# EAGLE board DATALOGGER_ADS_V1 (EAGLE 9.6.2), part 1 of 2
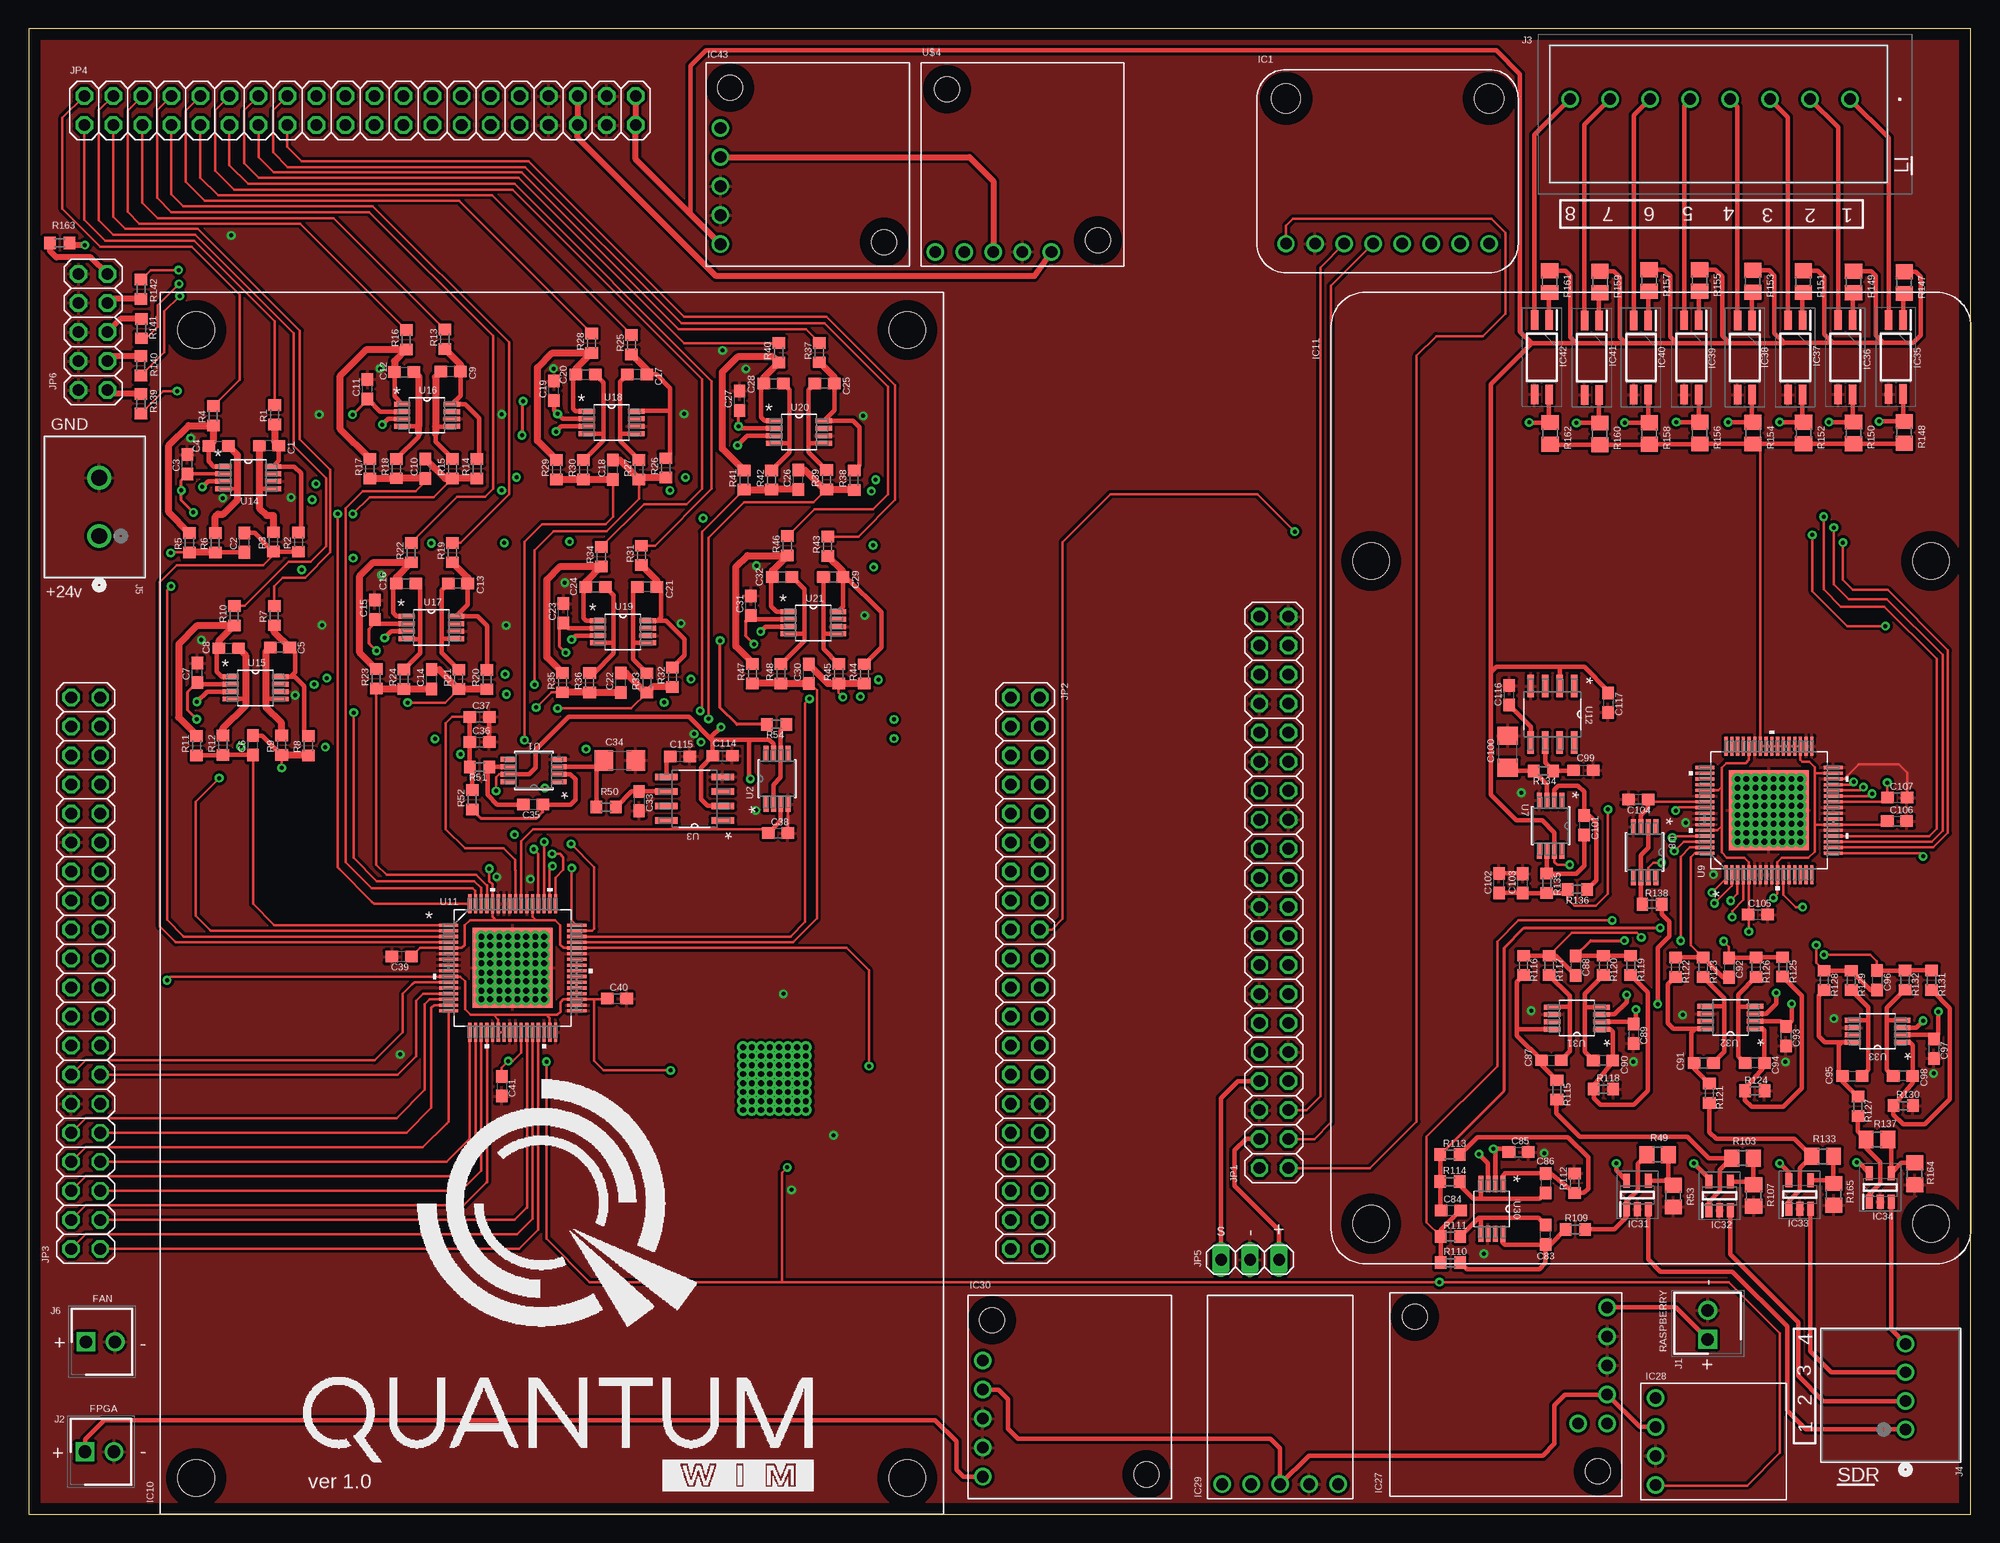
[diagram p21: board, top side]
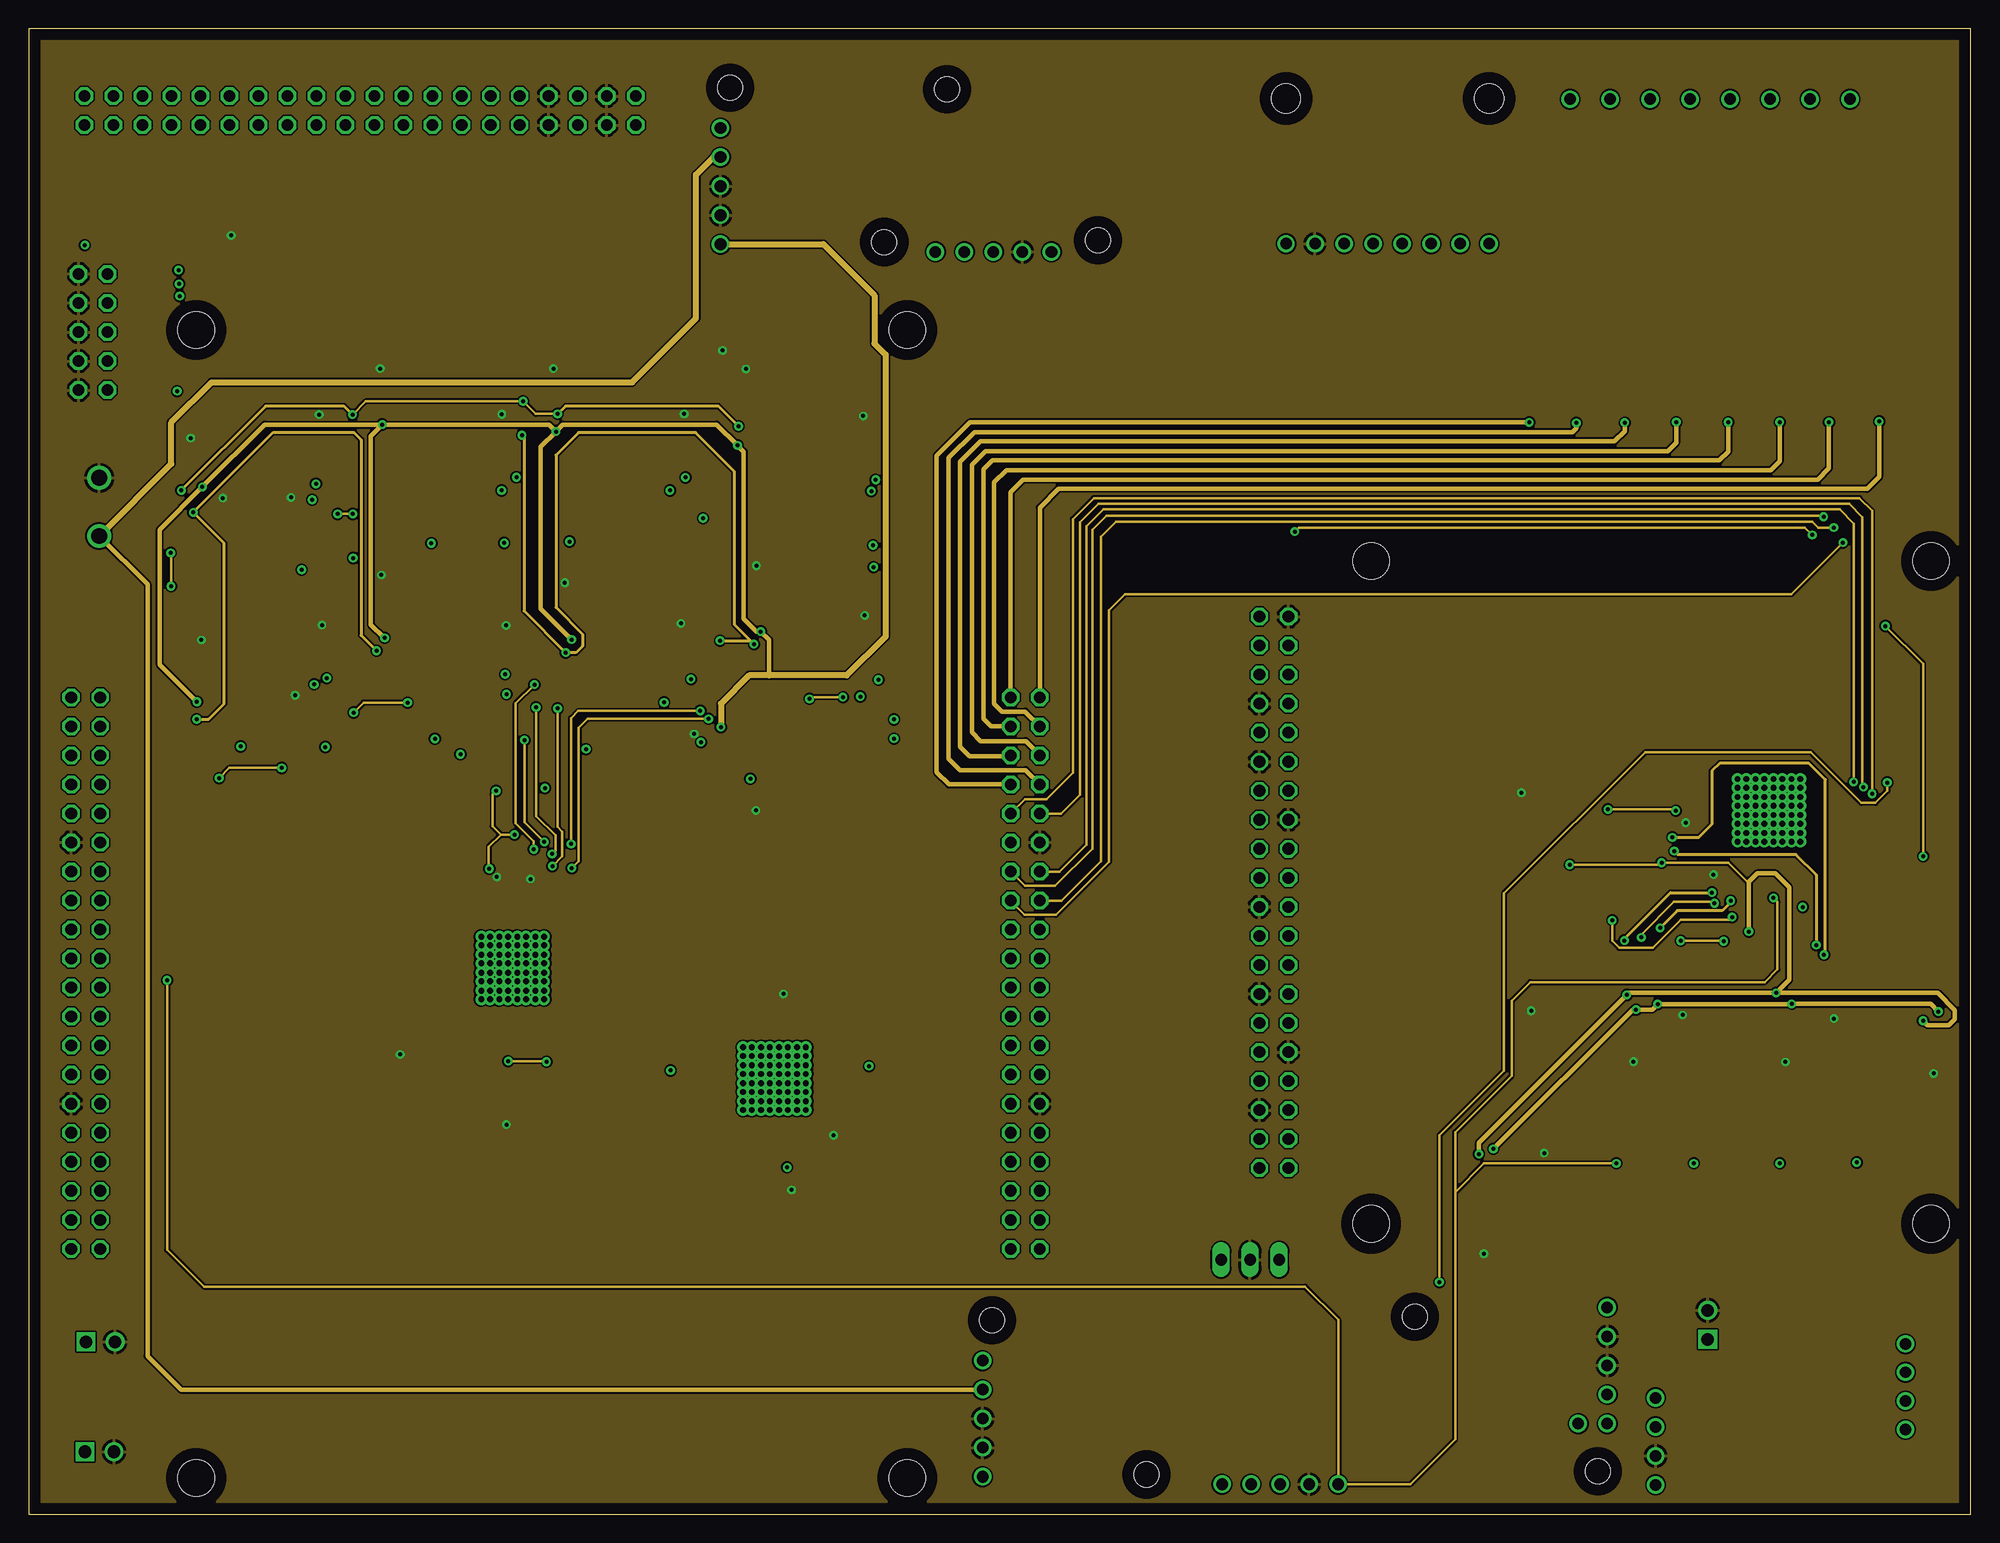
[diagram p22: board, inner layer Route2]
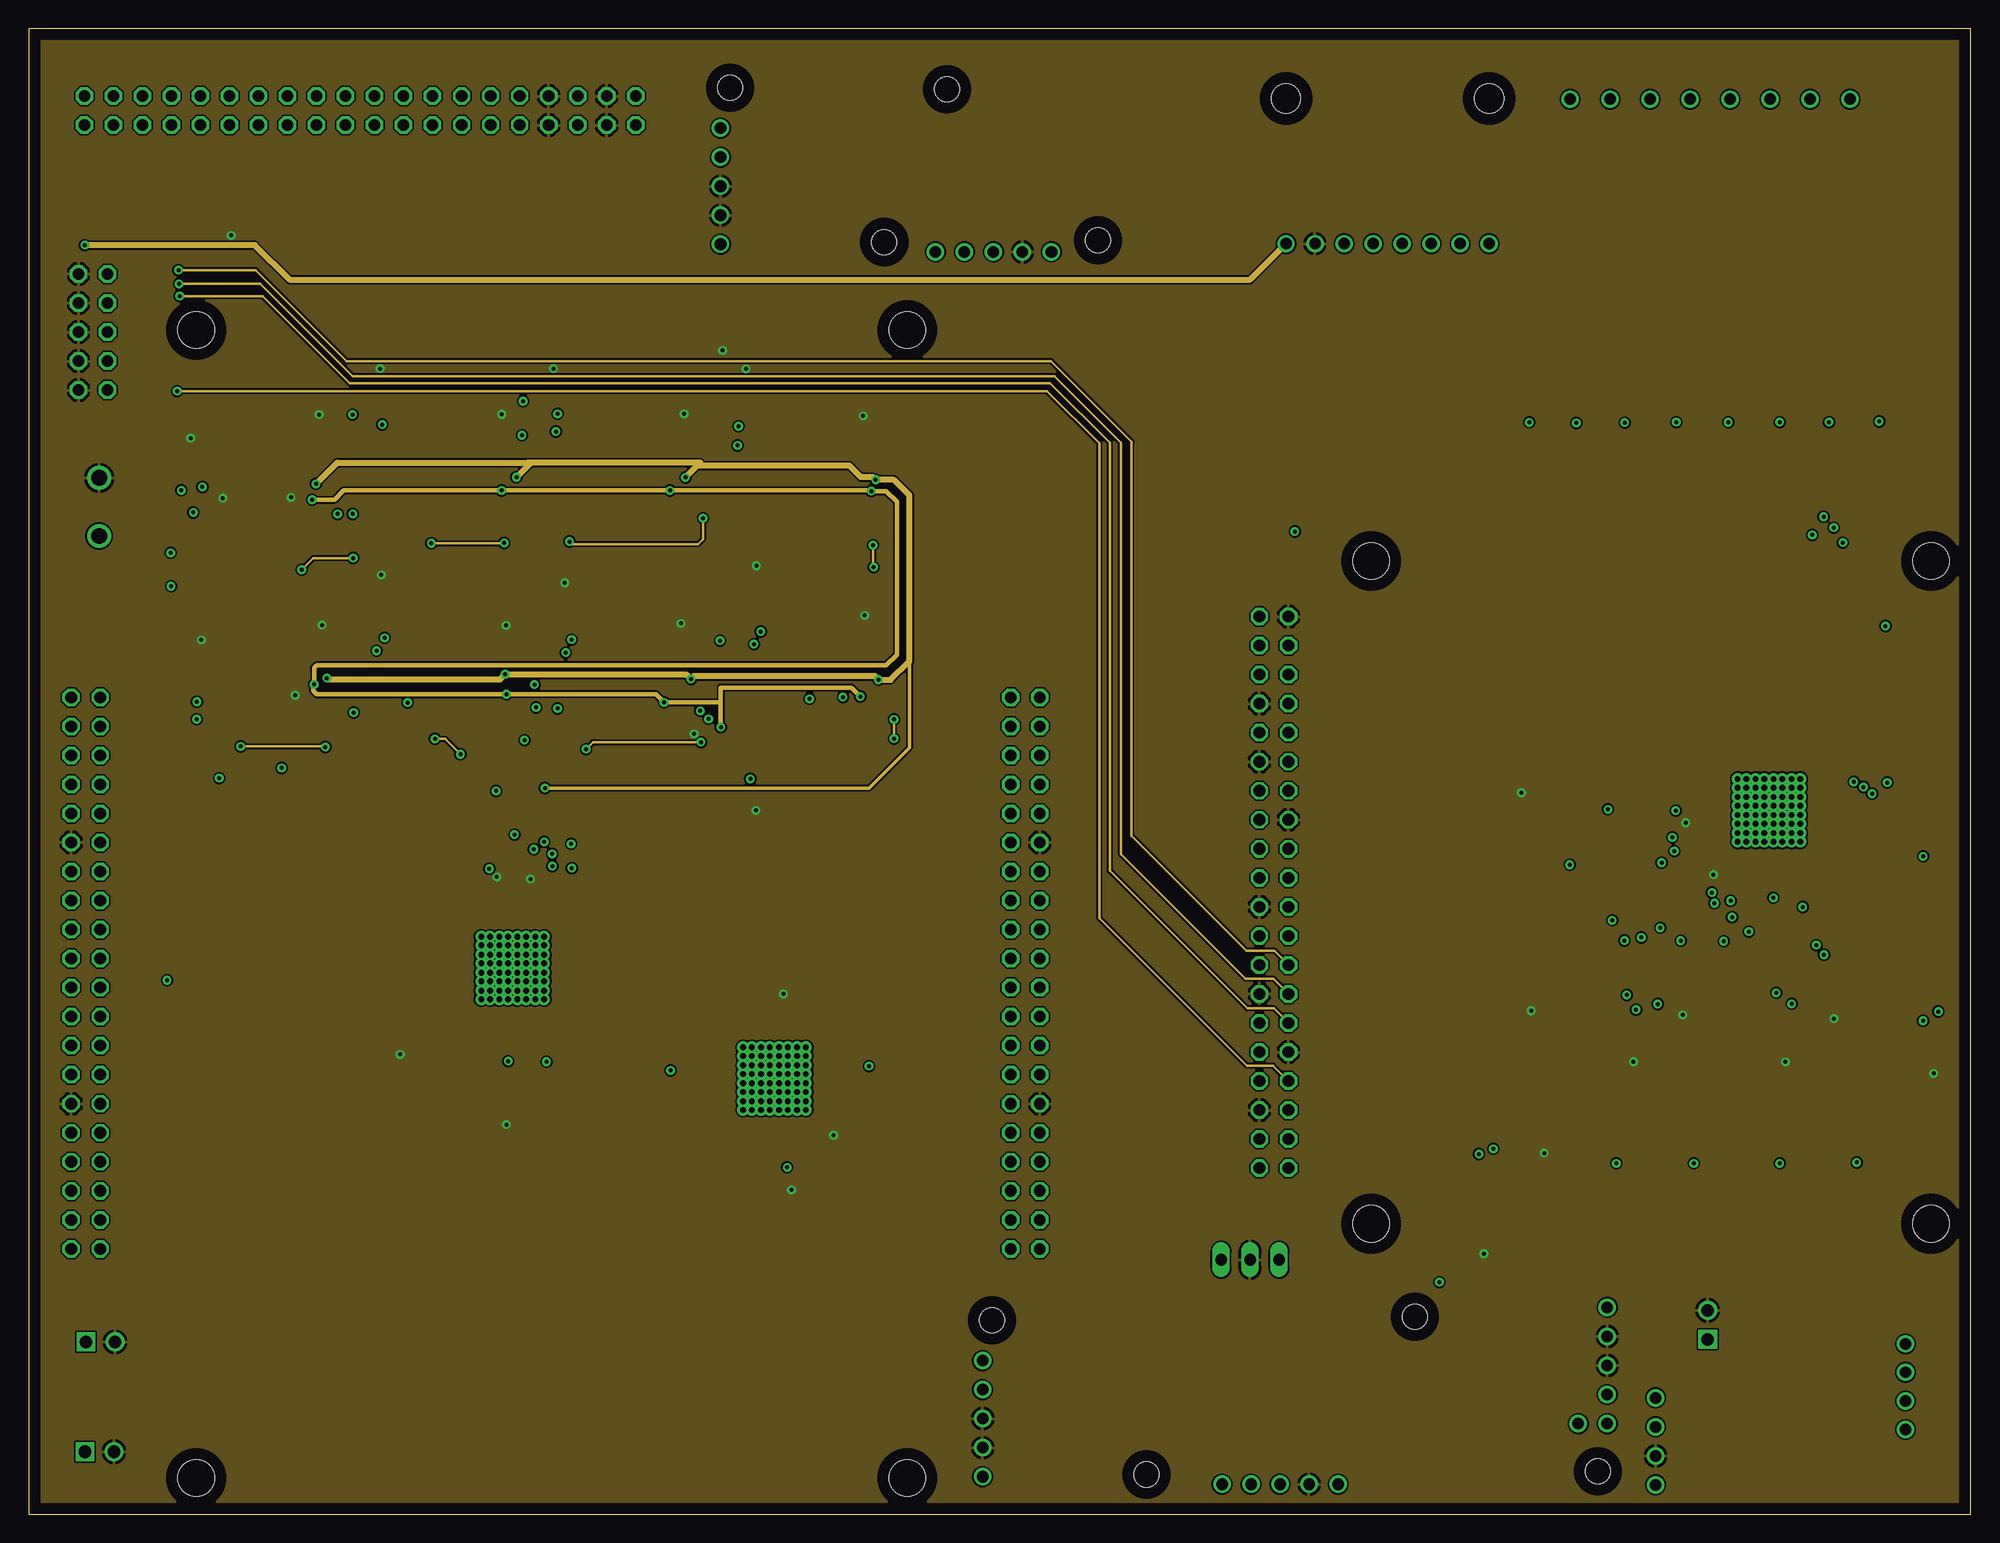
[diagram p23: board, inner layer Route15]
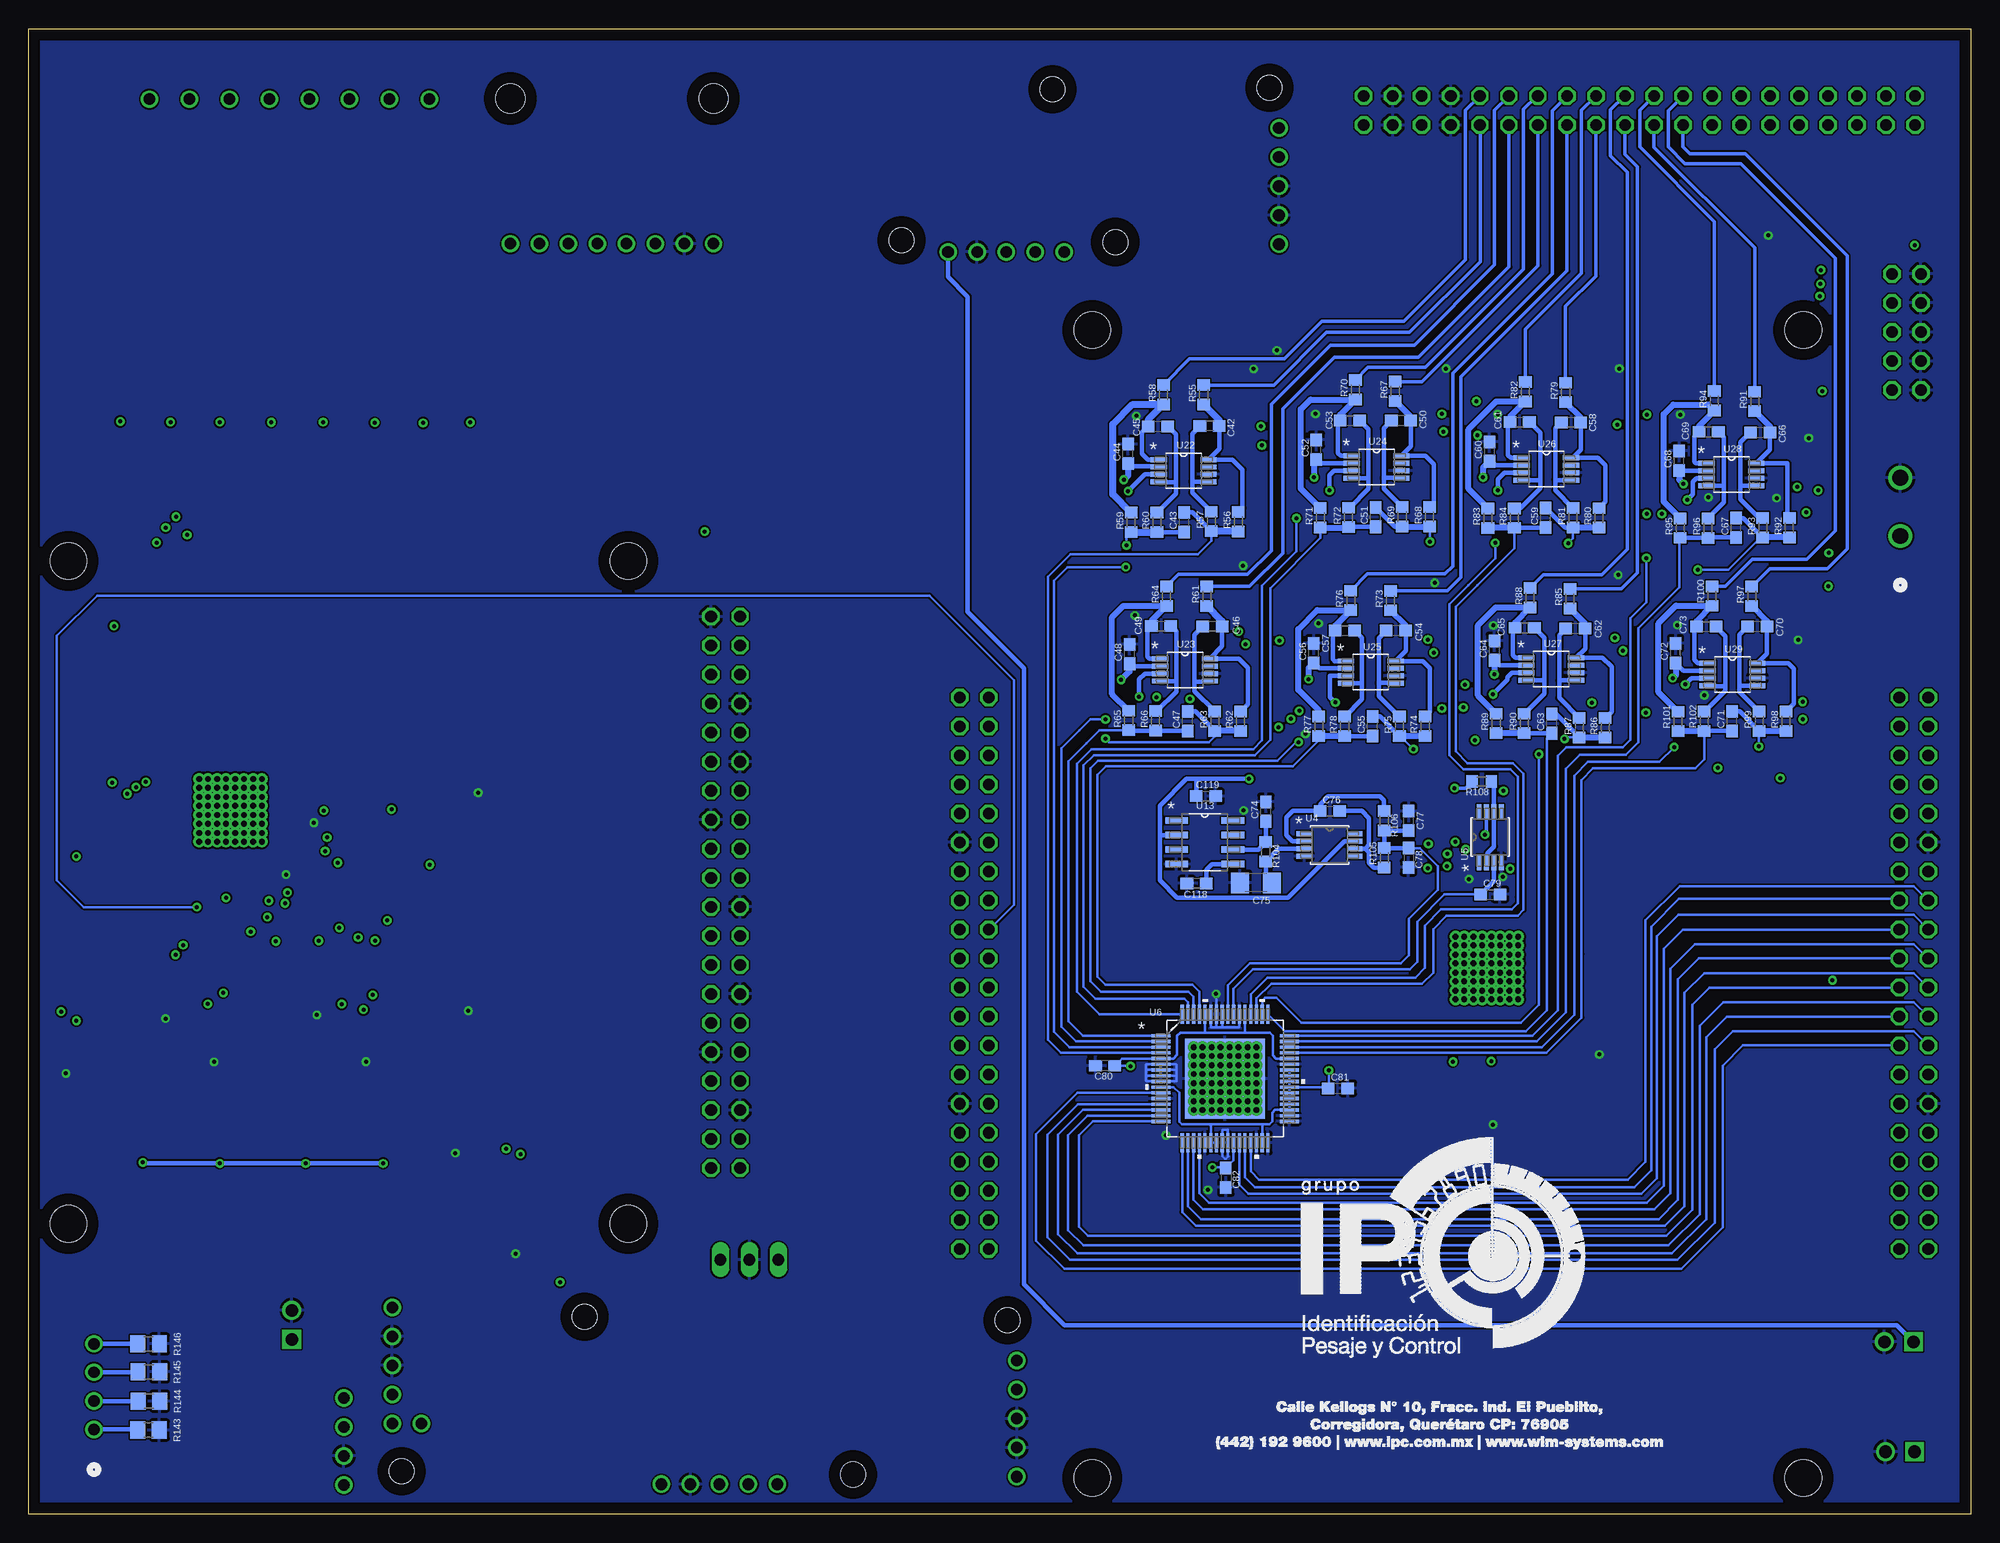
[diagram p24: board, bottom side, seen from below]

Size 170 x 130 mm. Coordinates in mm from the lower left corner, seen from the top.
Outline: 0,0 170,0 170,130 0,130 0,0
Copper layers ([2:1+(2*15)+16:15]): Top 0.035mm / dielectric 12mil / Route2 0.035mm / dielectric 27mil / Route15 0.035mm / dielectric 12mil / Bottom 0.035mm
Design rules "default *": minimum track width 6mil, minimum drill 0.35mm, track to track 6mil, track to pad 6mil, pad to pad 6mil, via to via 6mil, smd to smd 6mil, copper to edge 40mil, drill to drill 6mil, minimum pad ring 10mil, minimum via ring 8mil, stop-mask expansion 4mil, vias tented up to drill 0mil, thermal gap 10mil

## Footprints (pad centres in the part's own frame; a part is rotated, then mirrored left to right if it is on the bottom)
C0603 = smd 1.1 x 1: 1 -0.85,0; 2 0.85,0
C1206 = smd 1.6 x 1.8: 1 -1.4,0; 2 1.4,0
DS3231 = drill 1: 32K 15.24,2.54; BAT 12.7,2.54; GND 5.08,2.54; RES 20.32,2.54; SCL 7.62,2.54; SDA 10.16,2.54; SQW 17.78,2.54; VIN 2.54,2.54 | hole 2.54: 2.54,15.24; 20.32,15.24
DE10_NANO = hole 3.2: 3.18,3.18; 65.41,3.18; 65.41,103.62; 3.18,103.62
RASPBERRY_PI_4 = hole 3.2: 3.5,3.5; 52.5,3.5; 3.5,61.5; 52.5,61.5
D36V28F5-5V-3.2A = drill 1.02: 1 6.37,3.81; 2 6.37,1.27; 3 8.91,1.27; 4 11.45,1.27; 5 13.99,1.27; 6 16.53,1.27 | hole 2.18: 2.2,2.1; 15.7,18.1
D24V5F1 = drill 1.02: 1 1.27,1.27; 2 3.81,1.27; 3 6.35,1.27; 4 8.89,1.27
D24V10F3-3.3V-1A = drill 1.02: 1 1.27,1.27; 2 3.81,1.27; 3 6.35,1.27; 4 8.89,1.27; 5 11.43,1.27
D24V25F5-5V-2.5A = drill 1.02: EN 5.73,1.27; GND@3 10.81,1.27; GND@4 13.35,1.27; VIN 8.27,1.27; VOUT 15.89,1.27 | hole 2.18: 2.2,2.1; 15.7,15.6
SOT95P280X145-5N = smd 1.2 x 0.6: 1 -1.25,0.95; 2 -1.25,0; 3 -1.25,-0.95; 4 1.25,-0.95; 5 1.25,0.95
SOIC127P700X220-4N = smd 1.7 x 0.65: 1 -3.25,0.635; 2 -3.25,-0.635; 3 3.25,-0.635; 4 3.25,0.635
SHDR2W64P0X254_1X2_508X580X117 = drill 1.1 pad 1.65 square: 1 0,0 | drill 1.1 pad 1.65: 2 2.54,0
1985027 = drill 1 pad 1.5: 1 0,0; 2 3.5,0; 3 7,0; 4 10.5,0; 5 14,0; 6 17.5,0; 7 21,0; 8 24.5,0
CONN_1989764_PXC = drill 0.991 pad 1.499: 1 0,0; 2 2.489,0; 3 5.004,0; 4 7.493,0
CONN_1924305 = drill 1.397 pad 1.905: 1 -5.08,0; 2 0,0
2X20 = drill 1.016 octagon: 1 -24.13,-1.27; 2 -24.13,1.27; 3 -21.59,-1.27; 4 -21.59,1.27; 5 -19.05,-1.27; 6 -19.05,1.27; 7 -16.51,-1.27; 8 -16.51,1.27; 9 -13.97,-1.27; 10 -13.97,1.27; 11 -11.43,-1.27; 12 -11.43,1.27; 13 -8.89,-1.27; 14 -8.89,1.27; 15 -6.35,-1.27; 16 -6.35,1.27; 17 -3.81,-1.27; 18 -3.81,1.27; 19 -1.27,-1.27; 20 -1.27,1.27; 21 1.27,-1.27; 22 1.27,1.27; 23 3.81,-1.27; 24 3.81,1.27; 25 6.35,-1.27; 26 6.35,1.27; 27 8.89,-1.27; 28 8.89,1.27; 29 11.43,-1.27; 30 11.43,1.27; 31 13.97,-1.27; 32 13.97,1.27; 33 16.51,-1.27; 34 16.51,1.27; 35 19.05,-1.27; 36 19.05,1.27; 37 21.59,-1.27; 38 21.59,1.27; 39 24.13,-1.27; 40 24.13,1.27
1X03 = drill 1.016 long: 1 -2.54,0; 2 0,0; 3 2.54,0
2X05 = drill 1.016 octagon: 1 -5.08,-1.27; 2 -5.08,1.27; 3 -2.54,-1.27; 4 -2.54,1.27; 5 0,-1.27; 6 0,1.27; 7 2.54,-1.27; 8 2.54,1.27; 9 5.08,-1.27; 10 5.08,1.27
R0603 = smd 1 x 1.1: 1 -0.85,0; 2 0.85,0
R0805 = smd 1.3 x 1.5: 1 -0.95,0; 2 0.95,0
DGK8_TEX = smd 1.333 x 0.432: 1 -2.216,0.975; 2 -2.216,0.325; 3 -2.216,-0.325; 4 -2.216,-0.975; 5 2.216,-0.975; 6 2.216,-0.325; 7 2.216,0.325; 8 2.216,0.975
D8 = smd 1.981 x 0.559: 1 -2.464,1.905; 2 -2.464,0.635; 3 -2.464,-0.635; 4 -2.464,-1.905; 5 2.464,-1.905; 6 2.464,-0.635; 7 2.464,0.635; 8 2.464,1.905
PAP64_7X7 = smd 1.664 x 0.279: 1 -5.62,3.75; 2 -5.62,3.25; 3 -5.62,2.75; 4 -5.62,2.25; 5 -5.62,1.75; 6 -5.62,1.25; 7 -5.62,0.75; 8 -5.62,0.25; 9 -5.62,-0.25; 10 -5.62,-0.75; 11 -5.62,-1.25; 12 -5.62,-1.75; 13 -5.62,-2.25; 14 -5.62,-2.75; 15 -5.62,-3.25; 16 -5.62,-3.75; 33 5.62,-3.75; 34 5.62,-3.25; 35 5.62,-2.75; 36 5.62,-2.25; 37 5.62,-1.75; 38 5.62,-1.25; 39 5.62,-0.75; 40 5.62,-0.25; 41 5.62,0.25; 42 5.62,0.75; 43 5.62,1.25; 44 5.62,1.75; 45 5.62,2.25; 46 5.62,2.75; 47 5.62,3.25; 48 5.62,3.75 | smd 0.279 x 1.664: 17 -3.75,-5.62; 18 -3.25,-5.62; 19 -2.75,-5.62; 20 -2.25,-5.62; 21 -1.75,-5.62; 22 -1.25,-5.62; 23 -0.75,-5.62; 24 -0.25,-5.62; 25 0.25,-5.62; 26 0.75,-5.62; 27 1.25,-5.62; 28 1.75,-5.62; 29 2.25,-5.62; 30 2.75,-5.62; 31 3.25,-5.62; 32 3.75,-5.62; 49 3.75,5.62; 50 3.25,5.62; 51 2.75,5.62; 52 2.25,5.62; 53 1.75,5.62; 54 1.25,5.62; 55 0.75,5.62; 56 0.25,5.62; 57 -0.25,5.62; 58 -0.75,5.62; 59 -1.25,5.62; 60 -1.75,5.62; 61 -2.25,5.62; 62 -2.75,5.62; 63 -3.25,5.62; 64 -3.75,5.62 | smd 7 x 7: 65 0,0 | drill 0.508 pad 0.508: V -2.743,-2.743; V_1 -2.743,-1.981; V_2 -2.743,-1.168; V_3 -2.743,-0.406; V_4 -2.743,0.406; V_5 -2.743,1.168; V_6 -2.743,1.981; V_7 -2.743,2.743; V_8 -1.981,-2.743; V_9 -1.981,-1.981; V_10 -1.981,-1.168; V_11 -1.981,-0.406; V_12 -1.981,0.406; V_13 -1.981,1.168; V_14 -1.981,1.981; V_15 -1.981,2.743; V_16 -1.168,-2.743; V_17 -1.168,-1.981; V_18 -1.168,-1.168; V_19 -1.168,-0.406; V_20 -1.168,0.406; V_21 -1.168,1.168; V_22 -1.168,1.981; V_23 -1.168,2.743; V_24 -0.406,-2.743; V_25 -0.406,-1.981; V_26 -0.406,-1.168; V_27 -0.406,-0.406; V_28 -0.406,0.406; V_29 -0.406,1.168; V_30 -0.406,1.981; V_31 -0.406,2.743; V_32 0.406,-2.743; V_33 0.406,-1.981; V_34 0.406,-1.168; V_35 0.406,-0.406; V_36 0.406,0.406; V_37 0.406,1.168; V_38 0.406,1.981; V_39 0.406,2.743; V_40 1.168,-2.743; V_41 1.168,-1.981; V_42 1.168,-1.168; V_43 1.168,-0.406; V_44 1.168,0.406; V_45 1.168,1.168; V_46 1.168,1.981; V_47 1.168,2.743; V_48 1.981,-2.743; V_49 1.981,-1.981; V_50 1.981,-1.168; V_51 1.981,-0.406; V_52 1.981,0.406; V_53 1.981,1.168; V_54 1.981,1.981; V_55 1.981,2.743; V_56 2.743,-2.743; V_57 2.743,-1.981; V_58 2.743,-1.168; V_59 2.743,-0.406; V_60 2.743,0.406; V_61 2.743,1.168; V_62 2.743,1.981; V_63 2.743,2.743
DGK8 = smd 1.422 x 0.432: 1 -2.172,0.975; 2 -2.172,0.325; 3 -2.172,-0.325; 4 -2.172,-0.975; 5 2.172,-0.975; 6 2.172,-0.325; 7 2.172,0.325; 8 2.172,0.975
D24V22F12 = drill 1.02: 1 1.27,1.27; 2 3.81,1.27; 3 6.35,1.27; 4 8.89,1.27; 5 11.43,1.27 | hole 2.18: 15.5,2.3; 2.3,15.5

## Placement (x,y rotation side)
C1  2.7nF  [C0603]  21.04,93.5 180 top
C2  2.2nF  [C0603]  18.91,85.03 90 top
C3  0.1uF  [C0603]  13.9,91.88 90 top
C4  2.7nF  [C0603]  16.63,93.48 0 top
C5  2.7nF  [C0603]  22,75.86 180 top
C6  2.2nF  [C0603]  19.65,67.29 90 top
C7  0.1uF  [C0603]  14.77,73.63 90 top
C8  2.7nF  [C0603]  17.5,75.78 0 top
C9  2.7nF  [C0603]  36.95,99.98 180 top
C10  2.2nF  [C0603]  34.73,91.5 90 top
C11  0.1uF  [C0603]  29.66,98.45 90 top
C12  2.7nF  [C0603]  32.88,99.95 0 top
C13  2.7nF  [C0603]  37.58,81.46 180 top
C14  2.2nF  [C0603]  35.28,73.06 90 top
C15  0.1uF  [C0603]  30.3,79.14 90 top
C16  2.7nF  [C0603]  33.05,81.43 0 top
C17  2.7nF  [C0603]  53.25,99.74 180 top
C18  2.2nF  [C0603]  51.15,91.39 90 top
C19  0.1uF  [C0603]  45.99,98.31 90 top
C20  2.7nF  [C0603]  48.74,99.72 0 top
C21  2.7nF  [C0603]  54.12,81.15 180 top
C22  2.2nF  [C0603]  51.84,72.75 90 top
C23  0.1uF  [C0603]  46.82,78.84 90 top
C24  2.7nF  [C0603]  49.63,81.15 0 top
C25  2.7nF  [C0603]  69.68,98.94 180 top
C26  2.2nF  [C0603]  67.37,90.52 90 top
C27  0.1uF  [C0603]  62.23,97.44 90 top
C28  2.7nF  [C0603]  65.19,98.94 0 top
C29  2.7nF  [C0603]  70.43,82 180 top
C30  2.2nF  [C0603]  68.28,73.53 90 top
C31  0.1uF  [C0603]  63.23,79.51 90 top
C32  2.7nF  [C0603]  65.95,82.03 0 top
C33  10uF  [C0603]  53.43,62.41 270 top
C34  100uF  [C1206]  51.75,65.96 0 top
C35  0.1uF  [C0603]  44.15,62.1 180 top
C36  0.1uF  [C0603]  39.47,67.58 0 top
C37  10uF  [C0603]  39.47,69.78 0 top
C38  0.1uF  [C0603]  65.6,59.61 0 top
C39  10uF  [C0603]  32.65,48.8 180 top
C40  10uF  [C0603]  51.49,45.13 0 top
C41  10uF  [C0603]  41.41,37.44 270 top
C42  2.7nF  [C0603]  66.63,95.22 180 bottom
C43  2.2nF  [C0603]  68.84,86.81 90 bottom
C44  0.1uF  [C0603]  73.77,92.79 90 bottom
C45  2.7nF  [C0603]  71.16,95.2 0 bottom
C46  2.7nF  [C0603]  66.39,77.68 180 bottom
C47  2.2nF  [C0603]  68.56,69.4 90 bottom
C48  0.1uF  [C0603]  73.64,75.27 90 bottom
C49  2.7nF  [C0603]  70.87,77.73 0 bottom
C50  2.7nF  [C0603]  49.87,95.69 180 bottom
C51  2.2nF  [C0603]  52.11,87.26 90 bottom
C52  0.1uF  [C0603]  57.29,93.16 90 bottom
C53  2.7nF  [C0603]  54.35,95.71 0 bottom
C54  2.7nF  [C0603]  50.32,77.32 180 bottom
C55  2.2nF  [C0603]  52.38,68.96 90 bottom
C56  0.1uF  [C0603]  57.51,75.35 90 bottom
C57  2.7nF  [C0603]  54.79,77.33 0 bottom
C58  2.7nF  [C0603]  35,95.53 180 bottom
C59  2.2nF  [C0603]  37.21,87.19 90 bottom
C60  0.1uF  [C0603]  42.13,92.99 90 bottom
C61  2.7nF  [C0603]  39.5,95.58 0 bottom
C62  2.7nF  [C0603]  34.61,77.5 180 bottom
C63  2.2nF  [C0603]  36.68,69.19 90 bottom
C64  0.1uF  [C0603]  41.7,75.58 90 bottom
C65  2.7nF  [C0603]  39.06,77.57 0 bottom
C66  2.7nF  [C0603]  18.45,94.65 180 bottom
C67  2.2nF  [C0603]  20.55,86.32 90 bottom
C68  0.1uF  [C0603]  25.54,92.19 90 bottom
C69  2.7nF  [C0603]  22.96,94.72 0 bottom
C70  2.7nF  [C0603]  18.71,77.67 180 bottom
C71  2.2nF  [C0603]  20.9,69.4 90 bottom
C72  0.1uF  [C0603]  25.85,75.35 90 bottom
C73  2.7nF  [C0603]  23.16,77.67 0 bottom
C74  10uF  [C0603]  61.7,61.49 90 bottom
C75  100uF  [C1206]  62.57,55.25 180 bottom
C76  0.1uF  [C0603]  56.1,61.54 0 bottom
C77  0.1uF  [C0603]  49.21,60.67 90 bottom
C78  10uF  [C0603]  49.22,57.45 270 bottom
C79  0.1uF  [C0603]  42.06,54.23 0 bottom
C80  10uF  [C0603]  75.77,39.25 180 bottom
C81  10uF  [C0603]  55.4,37.27 0 bottom
C82  10uF  [C0603]  65.22,29.45 270 bottom
C83  2.7nF  [C0603]  132.76,24.45 90 top
C84  2.2nF  [C0603]  124.47,26.6 0 top
C85  0.1uF  [C0603]  130.41,31.7 0 top
C86  2.7nF  [C0603]  132.77,28.98 270 top
C87  2.7nF  [C0603]  133.28,39.73 0 top
C88  2.2nF  [C0603]  135.39,48.01 270 top
C89  0.1uF  [C0603]  140.46,42.05 270 top
C90  2.7nF  [C0603]  137.8,39.72 180 top
C91  2.7nF  [C0603]  146.6,39.5 0 top
C92  2.2nF  [C0603]  148.83,47.84 270 top
C93  0.1uF  [C0603]  153.8,41.84 270 top
C94  2.7nF  [C0603]  151.07,39.49 180 top
C95  2.7nF  [C0603]  159.61,38.35 0 top
C96  2.2nF  [C0603]  161.78,46.72 270 top
C97  0.1uF  [C0603]  166.75,40.74 270 top
C98  2.7nF  [C0603]  164.05,38.35 180 top
C99  10uF  [C0603]  136.09,65.1 0 top
C100  100uF  [C1206]  129.45,66.71 90 top
C101  0.1uF  [C0603]  136.15,60.29 270 top
C102  0.1uF  [C0603]  128.7,55.22 90 top
C103  10uF  [C0603]  130.78,55.2 90 top
C104  0.1uF  [C0603]  140.89,62.56 180 top
C105  10uF  [C0603]  151.36,52.48 0 top
C106  10uF  [C0603]  163.53,60.66 0 top
C107  10uF  [C0603]  163.54,62.71 0 top
C114  1uF  [C0603]  60.73,66.37 0 top
C115  1uF  [C0603]  57.02,66.32 0 top
C116  1uF  [C0603]  129.59,71.65 90 top
C117  1uF  [C0603]  138.23,71.02 270 top
C118  1uF  [C0603]  67.77,55.19 180 bottom
C119  1uF  [C0603]  66.95,62.84 0 bottom
IC1  DS3231  [DS3231]  107.52,108.64 0 top
IC10  DE10-NANO  [DE10_NANO]  11.5,0 0 top
IC11  RASPBERRY_PI_4  [RASPBERRY_PI_4]  114,21.92 0 top
IC27  D36V28F5-5V-3.2A  [D36V28F5-5V-3.2A]  139.44,1.57 90 top
IC28  D24V5F1-1.8V-500MA  [D24V5F1]  141.13,11.46 270 top
IC29  D24V10F3-3.3V-1A  [D24V10F3-3.3V-1A]  103.19,1.36 0 top
IC30  D24V25F5-5V-2.5A  [D24V25F5-5V-2.5A]  82.23,19.18 270 top
IC31  TLV2771CDBVR  [SOT95P280X145-5N]  140.81,27.94 90 top
IC32  TLV2771CDBVR  [SOT95P280X145-5N]  148,27.86 90 top
IC33  TLV2771CDBVR  [SOT95P280X145-5N]  155.01,27.98 90 top
IC34  TLV2771CDBVR  [SOT95P280X145-5N]  162.06,28.6 90 top
IC35  FODM217DV  [SOIC127P700X220-4N]  163.43,101.26 270 top
IC36  FODM217DV  [SOIC127P700X220-4N]  159.01,101.24 270 top
IC37  FODM217DV  [SOIC127P700X220-4N]  154.62,101.23 270 top
IC38  FODM217DV  [SOIC127P700X220-4N]  150.2,101.22 270 top
IC39  FODM217DV  [SOIC127P700X220-4N]  145.53,101.23 270 top
IC40  FODM217DV  [SOIC127P700X220-4N]  141.12,101.22 270 top
IC41  FODM217DV  [SOIC127P700X220-4N]  136.81,101.2 270 top
IC42  FODM217DV  [SOIC127P700X220-4N]  132.44,101.24 270 top
IC43  D24V25F5-5V-2.5A  [D24V25F5-5V-2.5A]  59.29,127.02 270 top
J1  22-29-2021  [SHDR2W64P0X254_1X2_508X580X117]  146.96,15.31 90 top
J2  22-29-2021  [SHDR2W64P0X254_1X2_508X580X117]  4.94,5.47 0 top
J3  1985027  [1985027]  159.41,123.82 180 top
J4  1989764  [CONN_1989764_PXC]  164.27,7.42 90 top
J5  1755736  [CONN_1924305]  6.18,90.68 90 top
J6  22-29-2021  [SHDR2W64P0X254_1X2_508X580X117]  5.03,15.09 0 top
JP1  [2X20]  109,54.42 90 top
JP2  [2X20]  87.23,47.35 270 top
JP3  [2X20]  5,47.35 90 top
JP4  [2X20]  29.01,122.83 0 top
JP5  [1X03]  106.91,22.28 0 top
JP6  [2X05]  5.64,103.45 90 top
R1  1K  [R0603]  21.54,96.2 90 top
R2  1K  [R0603]  23.63,85.07 90 top
R3  49.9  [R0603]  21.43,85.08 90 top
R4  1K  [R0603]  16.17,96.11 90 top
R5  1K  [R0603]  14.08,85.01 90 top
R6  49.9  [R0603]  16.35,85.01 90 top
R7  1K  [R0603]  21.51,78.64 90 top
R8  1K  [R0603]  24.49,67.25 90 top
R9  49.9  [R0603]  22.15,67.28 90 top
R10  1K  [R0603]  18,78.63 90 top
R11  1K  [R0603]  14.71,67.26 90 top
R12  49.9  [R0603]  17.01,67.28 90 top
R13  1K  [R0603]  36.44,102.81 90 top
R14  1K  [R0603]  39.25,91.49 90 top
R15  49.9  [R0603]  37.11,91.49 90 top
R16  1K  [R0603]  33.06,102.78 90 top
R17  1K  [R0603]  29.88,91.49 90 top
R18  49.9  [R0603]  32.19,91.5 90 top
R19  1K  [R0603]  37.09,84.15 90 top
R20  1K  [R0603]  40.12,73.04 90 top
R21  49.9  [R0603]  37.65,73.05 90 top
R22  1K  [R0603]  33.49,84.15 90 top
R23  1K  [R0603]  30.43,73.1 90 top
R24  49.9  [R0603]  32.86,73.08 90 top
R25  1K  [R0603]  52.77,102.35 90 top
R26  1K  [R0603]  55.78,91.55 90 top
R27  49.9  [R0603]  53.43,91.41 90 top
R28  1K  [R0603]  49.28,102.47 90 top
R29  1K  [R0603]  46.21,91.41 90 top
R30  49.9  [R0603]  48.57,91.39 90 top
R31  1K  [R0603]  53.64,83.9 90 top
R32  1K  [R0603]  56.35,73.25 90 top
R33  49.9  [R0603]  54.13,72.74 90 top
R34  1K  [R0603]  50.13,83.8 90 top
R35  1K  [R0603]  46.73,72.78 90 top
R36  49.9  [R0603]  49.1,72.76 90 top
R37  1K  [R0603]  69.21,101.65 90 top
R38  1K  [R0603]  72.25,90.48 90 top
R39  49.9  [R0603]  69.84,90.52 90 top
R40  1K  [R0603]  65.66,101.63 90 top
R41  1K  [R0603]  62.62,90.5 90 top
R42  49.9  [R0603]  65.03,90.5 90 top
R43  1K  [R0603]  69.94,84.7 90 top
R44  1K  [R0603]  73.16,73.53 90 top
R45  49.9  [R0603]  70.91,73.54 90 top
R46  1K  [R0603]  66.41,84.74 90 top
R47  1K  [R0603]  63.35,73.56 90 top
R48  49.9  [R0603]  65.85,73.55 90 top
R49  50M  [R0805]  142.57,31.47 180 top
R50  1K  [R0603]  50.55,61.88 180 top
R51  100  [R0603]  39.47,65.39 180 top
R52  1K  [R0603]  38.83,62.51 90 top
R53  1K  [R0805]  143.94,27.84 90 top
R54  100  [R0603]  65.48,69.12 180 top
R55  1K  [R0603]  67.15,97.95 90 bottom
R56  1K  [R0603]  64.12,86.85 90 bottom
R57  49.9  [R0603]  66.48,86.87 90 bottom
R58  1K  [R0603]  70.66,97.96 90 bottom
R59  1K  [R0603]  73.5,86.79 90 bottom
R60  49.9  [R0603]  71.24,86.79 90 bottom
R61  1K  [R0603]  66.88,80.34 90 bottom
R62  1K  [R0603]  63.92,69.4 90 bottom
R63  49.9  [R0603]  66.17,69.4 90 bottom
R64  1K  [R0603]  70.4,80.34 90 bottom
R65  1K  [R0603]  73.71,69.46 90 bottom
R66  49.9  [R0603]  71.36,69.43 90 bottom
R67  1K  [R0603]  50.39,98.26 90 bottom
R68  1K  [R0603]  47.39,87.27 90 bottom
R69  49.9  [R0603]  49.78,87.28 90 bottom
R70  1K  [R0603]  53.87,98.39 90 bottom
R71  1K  [R0603]  56.94,87.19 90 bottom
R72  49.9  [R0603]  54.48,87.22 90 bottom
R73  1K  [R0603]  50.8,79.95 90 bottom
R74  1K  [R0603]  47.77,68.95 90 bottom
R75  49.9  [R0603]  50.02,68.94 90 bottom
R76  1K  [R0603]  54.28,79.96 90 bottom
R77  1K  [R0603]  57.08,68.96 90 bottom
R78  49.9  [R0603]  54.81,68.95 90 bottom
R79  1K  [R0603]  35.48,98.16 90 bottom
R80  1K  [R0603]  32.55,87.18 90 bottom
R81  49.9  [R0603]  34.83,87.19 90 bottom
R82  1K  [R0603]  39,98.22 90 bottom
R83  1K  [R0603]  42.28,87.16 90 bottom
R84  49.9  [R0603]  39.96,87.17 90 bottom
R85  1K  [R0603]  35.1,80.12 90 bottom
R86  1K  [R0603]  32.01,68.82 90 bottom
R87  49.9  [R0603]  34.28,68.82 90 bottom
R88  1K  [R0603]  38.59,80.2 90 bottom
R89  1K  [R0603]  41.56,69.2 90 bottom
R90  49.9  [R0603]  39.09,69.2 90 bottom
R91  1K  [R0603]  18.93,97.37 90 bottom
R92  1K  [R0603]  15.89,86.32 90 bottom
R93  49.9  [R0603]  18.22,86.31 90 bottom
R94  1K  [R0603]  22.46,97.42 90 bottom
R95  1K  [R0603]  25.44,86.3 90 bottom
R96  49.9  [R0603]  23.02,86.29 90 bottom
R97  1K  [R0603]  19.19,80.33 90 bottom
R98  1K  [R0603]  16.19,69.39 90 bottom
R99  49.9  [R0603]  18.53,69.38 90 bottom
R100  1K  [R0603]  22.67,80.35 90 bottom
R101  1K  [R0603]  25.65,69.37 90 bottom
R102  49.9  [R0603]  23.35,69.4 90 bottom
R103  50M  [R0805]  150.01,31.17 180 top
R104  1K  [R0603]  61.72,57.97 270 bottom
R105  100  [R0603]  51.35,57.44 90 bottom
R106  1K  [R0603]  51.36,60.67 270 bottom
R107  1K  [R0805]  150.98,27.89 90 top
R108  100  [R0603]  42.82,64.12 180 bottom
R109  1K  [R0603]  135.37,24.92 0 top
R110  1K  [R0603]  124.45,22.02 0 top
R111  49.9  [R0603]  124.45,24.31 0 top
R112  1K  [R0603]  135.31,28.98 90 top
R113  1K  [R0603]  124.41,31.48 0 top
R114  49.9  [R0603]  124.4,29.11 0 top
R115  1K  [R0603]  133.76,37.13 270 top
R116  1K  [R0603]  130.84,48.02 270 top
R117  49.9  [R0603]  133.08,48.02 270 top
R118  1K  [R0603]  137.84,37.2 0 top
R119  1K  [R0603]  140.22,48.02 270 top
R120  49.9  [R0603]  137.83,48.02 270 top
R121  1K  [R0603]  147.1,36.84 270 top
R122  1K  [R0603]  144.14,47.87 270 top
R123  49.9  [R0603]  146.56,47.86 270 top
R124  1K  [R0603]  151.07,37.06 0 top
R125  1K  [R0603]  153.53,47.89 270 top
R126  49.9  [R0603]  151.19,47.88 270 top
R127  1K  [R0603]  160.11,35.7 270 top
R128  1K  [R0603]  157.16,46.71 270 top
R129  49.9  [R0603]  159.53,46.71 270 top
R130  1K  [R0603]  164.07,35.76 0 top
R131  1K  [R0603]  166.55,46.73 270 top
R132  49.9  [R0603]  164.23,46.75 270 top
R133  50M  [R0805]  157.02,31.32 180 top
R134  1K  [R0603]  132.58,65.05 180 top
R135  100  [R0603]  132.88,55.21 270 top
R136  1K  [R0603]  135.54,54.68 180 top
R137  50M  [R0805]  161.77,32.79 180 top
R138  100  [R0603]  142.09,53.38 0 top
R139  330R  [R0603]  9.84,97.18 90 top
R140  330R  [R0603]  9.83,100.49 90 top
R141  330R  [R0603]  9.88,103.75 90 top
R142  330R  [R0603]  9.85,107.19 270 top
R143  100M  [R0805]  159.51,7.37 0 bottom
R144  100M  [R0805]  159.47,9.9 0 bottom
R145  100M  [R0805]  159.47,12.46 0 bottom
R146  100M  [R0805]  159.5,14.92 0 bottom
R147  220R  [R0805]  164.15,107.77 270 top
R148  220R  [R0805]  164.15,94.67 270 top
R149  220R  [R0805]  159.73,107.83 270 top
R150  220R  [R0805]  159.72,94.62 270 top
R151  220R  [R0805]  155.32,107.86 270 top
R152  220R  [R0805]  155.35,94.61 270 top
R153  220R  [R0805]  150.9,107.89 270 top
R154  220R  [R0805]  150.92,94.6 270 top
R155  220R  [R0805]  146.25,107.95 270 top
R156  220R  [R0805]  146.26,94.6 270 top
R157  220R  [R0805]  141.83,107.95 270 top
R158  220R  [R0805]  141.84,94.57 270 top
R159  220R  [R0805]  137.53,107.82 270 top
R160  220R  [R0805]  137.51,94.54 270 top
R161  220R  [R0805]  133.13,107.86 270 top
R162  220R  [R0805]  133.17,94.58 270 top
R163  330R  [R0603]  2.74,111.25 180 top
R164  1K  [R0805]  165.07,29.79 90 top
R165  1K  [R0805]  157.99,27.99 90 top
U1  OPA350EA/2K5  [DGK8_TEX]  44.22,65.08 180 top
U2  OPA350EA/2K5  [DGK8_TEX]  65.51,64.36 90 top
U3  REF5025AID  [D8]  58.29,62.61 180 top
U4  OPA350EA/2K5  [DGK8_TEX]  56.13,58.57 0 bottom
U5  OPA350EA/2K5  [DGK8_TEX]  42.07,59.25 90 bottom
U6  ADS1278IPAPR  [PAP64_7X7]  65.28,38.13 0 bottom
U7  OPA350EA/2K5  [DGK8_TEX]  133.22,60.25 270 top
U8  OPA350EA/2K5  [DGK8_TEX]  141.43,57.94 270 top
U9  ADS1278IPAPR  [PAP64_7X7]  152.32,61.59 90 top
U11  ADS1278IPAPR  [PAP64_7X7]  42.37,47.8 0 top
U12  REF5025AID  [D8]  133.38,70 270 top
U13  REF5025AID  [D8]  67.06,58.8 0 bottom
U14  THS4521IDGKT  [DGK8]  19.23,90.7 0 top
U15  THS4521IDGKT  [DGK8]  19.86,72.31 0 top
U16  THS4521IDGKT  [DGK8]  34.87,96.16 0 top
U17  THS4521IDGKT  [DGK8]  35.26,77.6 0 top
U18  THS4521IDGKT  [DGK8]  51.03,95.53 0 top
U19  THS4521IDGKT  [DGK8]  52.02,77.22 0 top
U20  THS4521IDGKT  [DGK8]  67.44,94.69 0 top
U21  THS4521IDGKT  [DGK8]  68.68,78 0 top
U22  THS4521IDGKT  [DGK8]  68.91,91.31 0 bottom
U23  THS4521IDGKT  [DGK8]  68.78,73.89 0 bottom
U24  THS4521IDGKT  [DGK8]  52.02,91.64 0 bottom
U25  THS4521IDGKT  [DGK8]  52.53,73.69 0 bottom
U26  THS4521IDGKT  [DGK8]  37.16,91.47 0 bottom
U27  THS4521IDGKT  [DGK8]  36.73,73.96 0 bottom
U28  THS4521IDGKT  [DGK8]  20.95,90.98 0 bottom
U29  THS4521IDGKT  [DGK8]  20.88,73.48 0 bottom
U30  THS4521IDGKT  [DGK8]  128.07,26.72 270 top
U31  THS4521IDGKT  [DGK8]  135.51,43.41 180 top
U32  THS4521IDGKT  [DGK8]  148.95,43.46 180 top
U33  THS4521IDGKT  [DGK8]  161.82,42.27 180 top
U$4  D24V22F12-12V-2.2A  [D24V22F12]  78.09,109.19 0 top

## Tracks (layer width: path | path; a pad name or v marks a point on that pad's centre or on a via)
3.3V_RPI  (via drill 0.35)
  Top 0.2: 121.47,101.35 123.21,103.1 127.31,103.1 129.26,105.05 129.26,112.14 128.04,113.36 110.67,113.36 110.06,112.75 IC1.VIN
  Top 0.203: JP1.1 117.41,30.29 121.47,34.35 121.47,101.35
  Top 0.508: v4.93,111.05 3.8,111.05 R163.1
  Route15 0.508: v4.93,111.05 19.81,111.05 22.84,108.03 106.91,108.03 IC1.VIN
5V_2.5A
  Top 0.406: IC30.VOUT 81.81,3.29 81.2,3.9 81.2,6.38 79.34,8.24 6.61,8.24 4.94,6.57 J2.1
5V_3.2A
  Top 0.406: IC27.6 144.17,18.1 J1.1
5V_RPI
  Top 0.406: JP5.3 109.45,24.84 105.56,28.73 105.56,31.85 106.58,32.87 107.69,32.87 JP1.4
+1V8  (via drill 0.35, 0.35 pad 0.4)
  Top 0.2: U11.26 43.12,40.4 42.37,39.65 v41.98,39.65 | U9.26 162.32,62.34 C107.1 | 65.94,20.31 65.94,29.9 v66.4,30.35
  Top 0.203: C107.1 v162.69,64.02 v162.68,64.03 | IC28.4 142.46,2.51 150.42,2.51 153.28,5.37 153.28,15.85 148.82,20.31 v123.48,20.31 65.94,20.31 49.12,20.31 45.33,24.1 v45.33,39.6 | v41.98,39.65 41.41,39.08 C41.1
  Route2 0.203: v162.68,64.03 162.68,63.29 161.64,62.25 160.42,62.25 155.99,66.68 141.49,66.68 129.13,54.32 129.13,38.83 123.48,33.18 v123.48,20.31 | v45.33,39.6 45.28,39.65 v41.98,39.65
  Bottom 0.2: U6.26 64.53,30.99 C82.1 65.28,30.35 v66.4,30.35
+3V3  (via drill 0.35, 0.35 pad 0.4)
  Top 0.2: R154.2 151.57,93 U9.42 U9.41 U9.40 U9.39 U9.38 U9.37 U9.36 U9.35 155.07,66.01 155.25,65.84 155.85,65.84 156.34,65.35 156.34,64.9 | U11.42 U11.41 U11.40 U11.39 U11.38 U11.37 U11.36 U11.35 | U11.23 U11.22 41.12,43.26 40.69,43.69 | 40.69,43.69 38.68,43.69 38.2,44.17 38.2,46.63 37.78,47.05 U11.10 12.45,47.05 v12.12,46.72 | U11.31 45.62,43.41 45.34,43.69 | 40.69,43.69 45.34,43.69 | U11.35 46.8,45.05 46.56,44.81 46.56,43.97 46.28,43.69 45.34,43.69 | U9.23 U9.22 | U9.22 162.36,60.34 C106.1 | v152.71,53.94 153.07,54.3 U9.10 153.07,57.06 153.44,57.43 155.78,57.43 156.34,57.99 156.34,60.3 | 156.34,60.3 156.39,60.35 U9.22 | 156.34,60.3 156.34,64.9 | U9.31 156.39,64.84 156.34,64.9 | v56.19,38.84 50.34,38.84 49.51,39.67 49.51,45.05 | U11.35 49.51,45.05 | 49.51,45.05 50.56,45.05 50.6,45.09
  Top 0.203: 50.6,45.09 C40.1
  Top 0.406: R162.2 133.21,93.59 R160.2 141.81,93.59 R158.2 146.23,93.62 R156.2 R154.2 R152.2 R150.2 164.1,93.67 R148.2 | IC31.5 138.96,30.09 v138.96,30.71 | v160,30.79 160.18,30.79 IC34.5 | IC33.5 154.06,29.91 v153.26,30.71 | IC32.5 147.05,29.41 v145.75,30.71
  Route2 0.2: 124.87,28.19 127.39,30.71 v138.96,30.71
  Route2 0.203: v152.71,53.94 153.07,53.58 153.07,47.68 151.95,46.56 131.44,46.56 129.81,44.93 129.81,38.39 124.87,33.45 124.87,28.19 124.87,6.58 120.92,2.63 IC29.5 114.62,17.01 111.72,19.91 15.35,19.91 12.12,23.14 v12.12,46.72
  Bottom 0.2: U6.10 69.79,37.38 69.29,36.88 69.29,34.37 69.04,34.11 66.62,34.11 | 66.62,34.11 66.53,34.02 U6.22 U6.23 | U6.31 62.03,34.11 | 62.03,34.11 66.62,34.11 | 62.03,34.11 61.42,34.11 61.14,34.39 61.14,35.15 60.92,35.38 U6.35 U6.36 U6.37 U6.38 U6.39 | U6.39 U6.40 U6.41 U6.42 | U6.39 56.35,37.38 56.34,37.36 | 56.34,37.36 C81.1 | v56.19,38.84 56.19,37.52 56.34,37.36
  Bottom 0.406: v138.96,30.71 v145.75,30.71 v153.26,30.71 159.92,30.71 v160,30.79
+5V  (via drill 0.35, 0.35 pad 0.4)
  Top 0.2: v40.33,56.49 40.33,55.4 40.62,55.11 U11.60 40.62,52.27 40.89,51.99 | 44.42,51.99 46.1,51.99 46.53,51.56 46.53,49.84 46.81,49.55 U11.44 71.61,49.55 73.56,47.6 v73.56,39.22 | U11.53 44.12,52.3 44.42,51.99 | 44.42,51.99 40.89,51.99 | 40.89,51.99 38.63,51.99 38.18,51.54 38.18,49.81 37.92,49.55 U11.5 34.26,49.55 C39.1 | U9.44 150.57,66.02 150.29,65.73 148.59,65.73 148.18,65.33 148.18,63.65 | U9.53 147.88,63.34 148.18,63.65 | U9.60 147.81,59.84 148.18,60.22 | 148.18,60.22 148.18,63.65 | C105.1 150.57,52.54 U9.5 150.57,57.05 150.16,57.45 148.64,57.45 148.18,57.91 148.18,60.22
  Top 0.203: U7.7 133.54,57.08 133.79,56.83 v134.89,56.83 | v142.93,57.01 142.21,57.01 141.75,56.55 U8.7 | v150.56,50.98 150.56,52.45 C105.1 | v40.92,63.29 40.9,63.31 40.9,64.49 41.16,64.75 U1.7
  Top 0.254: C105.1
  Top 0.406: U1.7 43.81,64.75 44.38,65.32 44.38,66.9 47.25,69.77 57.8,69.77 59.79,67.78 | U7.7 133.54,59.66 132.49,60.71 130.23,60.71 128,62.94 128,73.68 | 128,73.68 128.46,74.14 134.01,74.14 | 134.01,74.14 136.16,74.14 138.23,72.07 C117.1 | R149.1 161.26,108.78 161.66,108.38 161.66,103.16 162.32,102.5 | 162.32,102.5 164.97,102.5 165.62,103.15 165.62,108.29 165.19,108.72 R147.1 | R151.1 156.6,108.81 157.16,108.25 157.16,103.27 157.93,102.5 | 157.93,102.5 162.32,102.5 | R153.1 152.35,108.84 152.81,108.38 152.81,103.36 153.67,102.5 | 153.67,102.5 157.93,102.5 | R155.1 147.64,108.9 148.22,108.32 148.22,103.14 148.9,102.46 | 148.9,102.46 153.63,102.46 153.67,102.5 | R157.1 143.13,108.9 143.67,108.36 143.67,103.03 144.24,102.46 | 144.24,102.46 148.9,102.46 | R159.1 138.75,108.77 139.27,108.25 139.27,103.01 139.82,102.46 | 139.82,102.46 144.24,102.46 | R161.1 134.51,108.81 134.94,108.38 134.94,102.99 135.47,102.46 | 139.82,102.46 135.47,102.46 | U2.7 65.19,67.41 64.81,67.78 63.08,67.78 | 63.08,67.78 59.79,67.78 | v60.59,68.88 59.73,68.01 59.79,67.95 59.79,67.78 | 128,73.68 128,98.89 131.57,102.46 | 63.08,67.78 63.08,64.44 v63.17,64.35 | IC43.VOUT 57.96,113.73 57.96,126.76 59.29,128.09 128.47,128.09 130.54,126.03 130.54,103.49 131.57,102.46 | U3.2 59.44,61.98 58.85,62.56 58.85,65.34 C114.1 59.88,67.69 59.79,67.78 | U12.2 134.01,74.14 | U30.3 127.74,30.73 v126.95,31.52 | v139.88,45.44 139.88,44.81 138.81,43.74 U31.3 | v152.96,45.62 152.96,44.65 152.09,43.78 U32.3 | v165.81,43.18 165.22,42.59 U33.3 | U15.3 15.63,71.99 v14.73,71.09 | v15.21,89.89 15.7,90.38 U14.3 | v30.96,95.35 31.45,95.84 U16.3
  Top 0.406: v31.17,76.68 31.75,77.27 U17.3 | v46.15,94.74 46.61,95.2 U18.3 | v47.52,76.53 47.88,76.89 U19.3 | v62.05,93.52 62.9,94.37 U20.3 | v64.08,77.24 64.52,77.68 U21.3 | 135.47,102.46 131.57,102.46
  Top 0.508: IC43.VOUT 53.14,118.55 JP4.39 JP4.40
  Route2 0.2: 40.61,60.21 41.35,59.47 | 41.35,59.47 v42.53,59.47 | v40.33,56.49 40.28,56.54 40.28,58.4 41.35,59.47
  Route2 0.203: v134.89,56.83 142.75,56.83 v142.93,57.01 148.76,57.01 150.56,55.21 v150.56,50.98 | 40.61,60.21 40.61,62.98 v40.92,63.29
  Route2 0.406: v126.95,31.52 126.95,32.51 v139.88,45.44 140.06,45.62 v152.96,45.62 | v152.96,45.62 167.08,45.62 168.6,44.09 168.6,43.33 168.07,42.8 166.19,42.8 v165.81,43.18 | v14.73,71.09 11.48,74.35 11.48,86.16 v15.21,89.89 20.68,95.35 v30.96,95.35 | v30.96,95.35 29.95,94.34 29.95,77.85 31.11,76.68 v31.17,76.68 | v30.96,95.35 45.54,95.35 v46.15,94.74 | v46.15,94.74 44.81,93.4 44.81,79.25 v47.52,76.53 | v46.15,94.74 46.76,95.35 60.22,95.35 v62.05,93.52 62.59,92.99 62.59,78.36 63.7,77.24 v64.08,77.24 64.82,76.5 64.82,73.41 | v152.96,45.62 154.1,46.76 154.1,54.86 152.88,56.08 151.28,56.08 150.56,55.36 v150.56,50.98
  Route2 0.508: IC43.VOUT 69.56,111.13 74.04,106.65 74.04,102.43 75,101.47 75,76.8 71.61,73.41 64.82,73.41 63.08,73.41 60.59,70.92 v60.59,68.88
  Route15 0.406: v24.82,88.77 26.77,88.77 27.58,89.59 v41.4,89.59 v56.13,89.59 73.71,89.59 v73.76,89.53 75.06,89.53 76,88.59 76,75.21 75.06,74.27 25.2,74.27 24.99,74.07 v24.99,72.62 24.89,72.62 24.89,72.06 25.2,71.75 v41.83,71.75 54.91,71.75 v55.63,71.04 60.58,71.04 | v72.8,71.55 72.01,72.34 60.58,72.34 60.58,71.04 | 60.58,71.04 60.58,68.89 v60.59,68.88
  Bottom 0.2: v73.56,39.22 73.59,39.25 C80.1 74.29,39.88 U6.5 69.8,39.88 69.47,40.21 69.47,41.86 69.19,42.14 67.03,42.14 | U6.53 63.53,42.14 | U6.44 60.83,39.88 61.11,40.16 61.11,41.88 61.37,42.14 63.53,42.14 | 63.53,42.14 67.03,42.14 | U6.60 67.03,42.14
  Bottom 0.305: U5.7 42.4,61.46 42.4,59.6 v42.53,59.48 v42.53,59.47
  Bottom 0.406: U4.7 54.84,58.9 59.79,53.95 69.48,53.95 71,55.47 71,59.44 | 67.82,64.35 68.64,64.35 71,61.99 71,59.44 | 67.82,64.35 v63.17,64.35 | U13.2 71,59.44 | C119.1 67.8,64.34 67.82,64.35 | U28.3 24.02,90.66 24.33,90.35 24.33,89.26 v24.82,88.77 | v73.76,89.53 72.31,90.99 U22.3 | U24.3 55.75,91.32 56.13,90.93 v56.13,89.59 | U26.3 40.81,91.14 41.4,90.55 v41.4,89.59 | v72.8,71.55 72.8,73.08 72.31,73.56 U23.3 | U25.3 56.08,73.36 56.08,71.5 v55.63,71.04 | U27.3 40.18,73.64 40.56,73.25 40.56,73.03 v41.83,71.75 | U29.3 24.45,73.16 v24.99,72.62
+12V
  Top 0.508: U$4.5 88,108.34 60.18,108.34 48.06,120.46 JP4.35 JP4.36
  Bottom 0.406: U$4.5 89.52,108.27 87.81,106.55 87.81,78.97 82.88,74.04 82.88,20.12 79.32,16.56 6.5,16.56 J6.1
+24V
  Top 0.406: IC28.2 141,7.65 IC27.3 134.46,10.48 133.54,9.56 133.54,6.16 132.52,5.14 112.05,5.14 IC29.3 109.54,5.78 108.69,6.63 86.61,6.63 85.74,7.5 85.74,10.05 84.88,10.91 IC30.VIN
  Top 0.508: IC43.VIN 82.34,118.75 84.44,116.65 U$4.3
  Route2 0.406: J5.1 10.41,81.37 10.41,13.85 13.35,10.91 IC30.VIN
  Route2 0.508: J5.1 12.5,91.92 12.5,95.54 16.01,99.05 52.83,99.05 58.42,104.64 58.42,117.23 59.94,118.75 IC43.VIN
AINN1_1
  Top 0.2: U11.4 12.89,50.05 12.85,50.09 | 11.48,81.56 12.95,83.03 20.55,83.03 21.43,83.91 R3.1
  Top 0.203: 12.85,50.09 11.48,51.46 11.48,81.56
  Top 0.406: R2.1 R3.1 19.78,85.88 C2.2
AINN1_2  (via drill 0.35)
  Top 0.2: U11.2 15.95,51.05 15.91,51.09 | R9.1 v22.15,65.31 v22.15,65.3 | v16.69,64.41 14.63,62.36 14.63,52.37
  Top 0.203: 14.63,52.37 15.91,51.09
  Top 0.406: R9.1 20.44,68.14 C6.2
  Top 0.61: R8.1 22.18,66.4 R9.1
  Route2 0.2: v22.15,65.3 17.58,65.3 v16.69,64.41
AINN1_3  (via drill 0.35)
  Top 0.2: 30.03,53.62 30.23,53.42 U11.64 | R15.1 35.47,89 29.85,89 v28.38,87.53 | v27.05,87.53 27.05,56.6 27.18,56.47
  Top 0.203: 27.18,56.47 30.03,53.62
  Top 0.61: R14.1 R15.1 36.44,90.64 C10.2
  Route2 0.2: v28.38,87.53 v27.05,87.53
AINN1_4  (via drill 0.35)
  Top 0.2: U11.62 39.62,54.8 39.6,54.82 | R21.1 36.47,71.02 v33.17,71.02 | v28.45,70.16 28.45,57.44 | C14.2 35.94,73.91
  Top 0.203: 39.6,54.82 39.01,55.41 30.48,55.41 28.45,57.44
  Top 0.61: R20.1 R21.1 35.94,73.91
  Route2 0.2: v28.45,70.16 29.31,71.02 v33.17,71.02
AINN1_5  (via drill 0.35)
  Top 0.2: v44.22,58.19 44.62,57.8 U11.52 | v44.27,72.59 44.27,84.35 45.95,86.03 50.6,86.03 53.43,88.86 R27.1
  Top 0.61: R26.1 53.57,90.7 R27.1 51.75,92.24 C18.2
  Route2 0.2: v44.22,58.19 44.22,58.88 42.65,60.45 42.65,70.97 v44.27,72.59
AINN1_6  (via drill 0.35)
  Top 0.2: R33.1 52.75,70.51 v46.3,70.51 | U11.50 45.62,56.49 v45.85,56.72
  Top 0.61: R32.1 54.63,72.4 R33.1 54.02,71.89 52.31,73.6 C22.2
  Route2 0.2: v46.3,70.51 46.3,60.15 46.71,59.74 46.71,57.58 v45.85,56.72
AINN1_7  (via drill 0.35)
  Top 0.2: R39.1 68.71,88.54 62.61,88.54 59.51,85.45 v59.51,69.6 | v47.55,56.54 47.55,51.99 U11.48
  Top 0.61: R38.1 69.88,89.63 R39.1 69.64,89.67 67.94,91.37 C26.2
  Route2 0.2: v59.51,69.6 48.92,69.6 48.16,68.83 48.16,57.15 v47.55,56.54
AINN1_8  (via drill 0.35)
  Top 0.2: U11.46 66.69,50.55 66.73,50.59 | R45.1 70.91,71.86 v71.27,71.5 | v68.35,71.34 67.97,70.96 67.97,51.83
  Top 0.203: 66.73,50.59 67.97,51.83
  Top 0.61: R44.1 R45.1 69.97,72.69 C30.2
  Route2 0.2: v71.27,71.5 68.51,71.5 v68.35,71.34
AINN2_1
  Bottom 0.2: U6.4 79.64,40.38 80.78,41.51 80.78,82.03 78.82,84 67.67,84 66.46,85.2 66.46,86
  Bottom 0.406: R57.1 68.12,87.66 C43.2
  Bottom 0.61: R56.1 66.46,86 R57.1
AINN2_2  (via drill 0.35)
  Route15 0.2: v75.74,67.87 v75.74,69.55
  Bottom 0.2: U6.2 78.31,41.38 79.58,42.65 79.58,51.99 | R63.1 66.17,68.07 66.67,67.56 75.44,67.56 v75.74,67.87 | v75.74,69.55 77.06,69.55 78.01,68.6
  Bottom 0.203: 79.58,51.99 79.58,67.03 78.01,68.6
  Bottom 0.406: R63.1 67.87,70.25 C47.2
  Bottom 0.508: R62.1 R63.1
AINN2_3  (via drill 0.35)
  Route15 0.2: v59.03,87.15 59.03,85.32 58.6,84.89 47.57,84.89 v47.35,85.11
  Bottom 0.2: U6.64 76.26,43.74 78.24,45.73 78.24,52.59 | 62.05,81.23 59.03,84.25 v59.03,87.15 | v47.35,85.11 47.35,86.38 R68.1
  Bottom 0.203: 78.24,52.59 78.24,65.69 76.98,66.95 62.81,66.95 62.05,67.71 62.05,81.23
  Bottom 0.406: C51.2 50.43,86.43 R69.1
  Bottom 0.508: R69.1 R68.1
AINN2_4  (via drill 0.35)
  Route15 0.2: v48.79,66.95 49.4,67.56 v58.85,67.56
  Bottom 0.2: U6.62 68.03,45.27 68.48,45.72 76.15,45.72 77.08,46.65 77.08,53.46 | R75.1 49.93,68.09 v48.79,66.95 | v58.85,67.56 59.07,67.56 60.71,65.93
  Bottom 0.203: 60.71,65.93 76.42,65.93 77.08,65.27 77.08,53.46
  Bottom 0.406: C55.2 51.72,69.81 R75.1
  Bottom 0.508: R74.1 R75.1
AINN2_5  (via drill 0.35)
  Route15 0.2: v35.26,84.96 41.6,84.96 v41.63,84.99
  Bottom 0.2: R81.1 34.83,85.39 v35.26,84.96 | v41.63,84.99 41.63,83.65 43.97,81.31 | 39.66,54.02 39.66,53.46 40.18,52.93 46.38,52.93 47.8,51.51 47.8,47.8 48.64,46.97 61.57,46.97 63.03,45.51 U6.52
  Bottom 0.203: 43.97,81.31 45.63,79.65 45.63,66.42 44.41,65.2 40.31,65.2 39.66,64.55 39.66,54.02
  Bottom 0.406: C59.2 35.5,86.33 R81.1
  Bottom 0.508: R80.1 R81.1
AINN2_6  (via drill 0.35)
  Route15 0.2: v35.57,67.84 36.45,67.84 v37.8,66.5
  Bottom 0.2: R87.1 35.44,67.97 v35.57,67.84 | v37.8,66.5 37.8,44.58 39.37,43 58.6,43 60.78,45.19 61.8,45.19 62.03,44.96 U6.50
  Bottom 0.406: R87.1 36.34,70.04 C63.2
  Bottom 0.508: R87.1 R86.1
AINN2_7  (via drill 0.35)
  Route15 0.2: v23.9,82.65 24.92,83.67 v28.41,83.67
  Bottom 0.2: U6.48 38.39,41.88 36.14,44.12 36.14,66.37 | R93.1 18.43,85.46 21.23,82.65 v23.9,82.65
  Bottom 0.203: 36.14,66.37 35.39,67.12 30.45,67.12 29.81,67.76 29.81,78.39 28.41,79.78 v28.41,83.67
  Bottom 0.406: R93.1 19.93,87.17 C67.2
  Bottom 0.508: R92.1 R93.1
AINN2_8  (via drill 0.35)
  Route15 0.2: v18.57,67.18 25.93,67.18 v25.98,67.14
  Bottom 0.2: U6.46 37.56,40.88 34.72,43.72 34.72,49.08 | R99.1 18.57,68.49 v18.57,67.18
  Bottom 0.203: 34.72,49.08 34.72,64.64 33.53,65.83 27.29,65.83 v25.98,67.14
  Bottom 0.406: R99.1 20.25,70.25 C71.2
  Bottom 0.508: R98.1 R99.1
AINN3_1  (via drill 0.35)
  Top 0.2: R111.1 122.35,25.56 122.35,33.02 128.55,39.22 128.55,50.11 130.4,51.97 v138.61,51.97 | U9.4 150.07,53.76 149.1,52.78 v149.1,52.25
  Top 0.406: R110.1 R111.1 123.6,24.88 C84.2
  Route2 0.2: v138.61,51.97 138.61,50.16 139.22,49.55 142.14,49.55 144.6,52.02 148.87,52.02 v149.1,52.25
AINN3_2  (via drill 0.35)
  Top 0.2: R117.1 135.09,50.88 140.74,50.88 v141.15,50.47 | v147.55,53.47 149.07,54.99 U9.2
  Top 0.406: R116.1 R117.1 133.68,48.87 C88.2
  Route2 0.2: v141.15,50.47 141.15,50.72 144.02,53.59 147.42,53.59 v147.55,53.47
AINN3_3
  Top 0.2: R123.1 145.47,49.8 145.47,57.48 145.85,57.86 146.69,57.86 U9.64
  Top 0.406: C92.2 148.28,46.99 R123.1 R122.1
AINN3_4  (via drill 0.35)
  Top 0.2: U9.62 144.85,58.84 v144.04,58.03 | v156.46,49.8 156.46,48.26 R128.1
  Top 0.406: R128.1 R129.1 161.22,45.87 C96.2
  Route2 0.254: v144.04,58.03 144.35,57.72 154.68,57.72 156.46,55.94 v156.46,49.8
AINP1_1  (via drill 0.35)
  Top 0.2: U11.3 13.59,50.55 13.55,50.59 | 12.13,77.4 12.13,80.86 v12.47,81.2 | v12.45,84.12 12.48,84.16 R5.1
  Top 0.203: 13.55,50.59 12.13,52.01 12.13,77.4
  Top 0.406: R6.1 18.89,84.16 C2.1
  Top 0.61: R6.1 R5.1
  Route2 0.2: v12.47,81.2 12.47,84.1 v12.45,84.12
AINP1_2
  Top 0.2: U11.1 21.51,51.55 21.47,51.59
  Top 0.203: 21.47,51.59 19.64,53.42 C6.1
  Top 0.406: R11.1 16.99,66.41 R12.1 C6.1
  Top 0.61: 16.99,66.41 R12.1
AINP1_3
  Top 0.2: U11.63 39.1,53.44 39.1,54.56
  Top 0.203: 39.1,54.56 38.88,54.78 30.04,54.78 27.75,57.07 27.75,88.03 29.24,89.52 33.86,89.52 34.74,90.4 C10.1
  Top 0.61: C10.1 R18.1 R17.1
AINP1_4
  Top 0.2: U11.61 40.12,55.02 40.1,55.04 | R23.1 30.43,56.85
  Top 0.203: 40.1,55.04 39.18,55.96 31.32,55.96 30.43,56.85
  Top 0.61: R23.1 32.84,72.25 R24.1 32.88,72.21 C14.1
AINP1_5  (via drill 0.35 pad 0.4)
  Top 0.2: 51.15,87.3 51.17,87.32 51.17,90.56 | v45.13,58.84 45.12,58.83 U11.51
  Top 0.203: 51.15,87.3 50.5,86.65 44.94,86.65 43.4,85.11 v43.4,67.74
  Top 0.61: 51.17,90.56 C18.1 R30.1 48.55,90.56 R29.1
  Route2 0.203: v43.4,67.74 43.4,60.57 v45.13,58.84
AINP1_6  (via drill 0.35 pad 0.4)
  Top 0.2: U11.49 46.12,55.72 46.79,56.39 46.79,57.51 46.51,57.78 v45.82,57.78
  Top 0.203: R35.1 45.78,71.93 44.45,70.6 v44.43,70.6
  Top 0.61: R35.1 46.75,71.91 R36.1 C22.1
  Route2 0.203: v44.43,70.6 44.43,61.09 46.11,59.41 46.11,58.07 v45.82,57.78
AINP1_7  (via drill 0.35 pad 0.4)
  Top 0.2: U11.47 49.33,51.05 49.51,51.23 49.51,56.63 v47.48,58.66
  Top 0.203: R41.1 58.95,85.97 58.95,70.45 v58.79,70.3
  Top 0.61: R41.1 R42.1 65.05,89.67 C26.1
  Route2 0.203: v47.48,58.66 47.48,69.67 48.11,70.3 v58.79,70.3
AINP1_8
  Top 0.2: 66.94,50.09 66.9,50.05 U11.45
  Top 0.203: 66.94,50.09 69,52.15 69,72.08 68.34,72.74
  Top 0.61: 68.34,72.74 C30.1 | C30.1 | R47.1 R48.1 68.28,72.7 C30.1
AINP2_1  (via drill 0.35)
  Route15 0.2: v73.91,84.78 73.91,82.93 v73.97,82.88
  Bottom 0.2: U6.3 78.9,40.88 80.25,42.23 80.25,51.82 | R59.1 73.91,85.53 v73.91,84.78 | v73.97,82.88 79.06,82.88 80.25,81.69
  Bottom 0.203: 80.25,81.69 80.25,51.82
  Bottom 0.406: R60.1 68.86,85.94 C43.1
  Bottom 0.61: R59.1 R60.1
AINP2_2
  Bottom 0.2: U6.1 77.72,41.88 79,43.16 79,65.87 | 77.42,67.45 76.26,68.61 R65.1
  Bottom 0.203: 77.42,67.45 79,65.87
  Bottom 0.406: C47.1 71.33,68.55 R66.1 73.68,68.58 R65.1
AINP2_3
  Bottom 0.2: U6.63 68.53,44.8 68.83,45.11 76.63,45.11 77.66,46.14 77.66,52.97 | 61.33,81.05 56.94,85.44 R71.1
  Bottom 0.203: 61.33,81.05 61.33,67.77 62.68,66.42 76.77,66.42 77.66,65.53 77.66,52.97
  Bottom 0.406: C51.1 54.44,86.41 54.51,86.34
  Bottom 0.508: R71.1 54.51,86.34 R72.1
AINP2_4
  Bottom 0.2: U6.61 67.53,45.73 68.12,46.33 75.77,46.33 76.46,47.02 76.46,53.84 | R77.1 57.08,67.73 59.36,65.45
  Bottom 0.203: 59.36,65.45 75.7,65.45 76.46,64.69 76.46,53.84
  Bottom 0.406: R78.1 C55.1
  Bottom 0.508: R77.1 R78.1
AINP2_5
  Bottom 0.2: 43.21,81.28 39.96,84.53 R84.1 | 39.16,53.76 39.16,52.89 39.67,52.38 45.9,52.38 47.07,51.21 47.07,47.4 48.03,46.43 61.24,46.43 62.53,45.14 U6.51
  Bottom 0.203: 39.16,53.76 39.16,64.78 40.09,65.71 44.06,65.71 45.1,66.75 45.1,79.39 43.21,81.28
  Bottom 0.406: C59.1 39.94,86.34 R84.1
  Bottom 0.508: R84.1 R83.1
AINP2_6
  Bottom 0.2: 37.11,44.09 38.94,42.27 58.72,42.27 60.05,42.27 U6.49 | 37.11,66.96 37.11,67.91 C63.1
  Bottom 0.203: 37.11,66.96 37.11,44.09
  Bottom 0.406: C63.1 R90.1
  Bottom 0.508: R90.1 R89.1
AINP2_7
  Bottom 0.2: U6.47 38,41.38 35.44,43.94 35.44,49.21 | 25.54,83.99 25.54,85.33 R95.1
  Bottom 0.203: 35.44,49.21 35.44,65.24 34.23,66.45 30.21,66.45 29.11,67.55 29.11,77.54 25.54,81.11 25.54,83.99
  Bottom 0.406: R95.1 R96.1 22.99,85.47 C67.1
  Bottom 0.508: R95.1
AINP2_8
  Bottom 0.2: U6.45 37.17,40.38 34.09,43.46 34.09,49.04 | 24.14,65.27 23.35,66.06 R102.1
  Bottom 0.203: 34.09,49.04 34.09,64.25 33.07,65.27 24.14,65.27
  Bottom 0.406: C71.1 R102.1
  Bottom 0.508: R101.1 25.62,68.55 R102.1
AINP3_1  (via drill 0.35)
  Top 0.2: U9.3 149.57,54.29 v148.97,53.68
  Top 0.254: C84.1 123.5,26.72 | R113.1 129.15,37.07 129.15,49.57 130.89,51.31 v142.8,51.31
  Top 0.406: R113.1 R114.1 123.55,26.78 123.5,26.72
  Route2 0.254: v142.8,51.31 144.3,52.81 148.23,52.81 148.97,53.55 v148.97,53.68
AINP3_2  (via drill 0.35)
  Top 0.2: v147.34,54.41 148.57,55.64 U9.1
  Top 0.254: C88.1 136.73,50.2 v139.68,50.2
  Top 0.406: R119.1 R120.1 C88.1
  Route2 0.254: v139.68,50.2 139.68,50.38 143.7,54.41 v147.34,54.41
AINP3_3  (via drill 0.35)
  Top 0.2: C92.1 148.83,49.65 148.36,50.11 v148.36,50.14 | v144.6,50.19 144.6,57.53 145.42,58.34 U9.63
  Top 0.406: R125.1 R126.1 151.15,48.69 C92.1
  Route2 0.2: v148.36,50.14 148.31,50.19 v144.6,50.19
AINP3_4  (via drill 0.35)
  Top 0.2: U9.61 143.97,59.34 v143.86,59.23 | C96.1 161.78,48.38 161.2,48.96 v157.14,48.96
  Top 0.406: C96.1 164.2,47.57 R132.1 166.53,47.6 R131.1
  Route2 0.2: v157.14,48.96 157.26,49.08
  Route2 0.254: v143.86,59.23 146.17,59.23 147.34,60.4 147.34,65.05 148.03,65.73 155.81,65.73 157.26,64.28 157.26,49.08
CLK1
  Top 0.2: U11.27 43.62,26.83 43.6,26.81
  Top 0.203: 43.6,26.81 42.56,25.77 6.63,25.77 JP3.3
CLK2
  Bottom 0.2: U6.27 64.03,28.85 63.22,28.04 28.83,28.04 27.48,29.39 27.48,37.92
  Bottom 0.203: 27.48,37.92 27.48,50.59 25.63,52.44 5,52.44 JP3.24
CLK3  (via drill 0.35)
  Top 0.2: U9.27 161.14,62.84 v161.34,63.05
  Route2 0.2: v161.34,63.05 161.34,87.8 160.23,88.91 93.24,88.91 91.4,87.07 91.4,64.87 89.11,62.58 87.22,62.58 JP2.9
DOBLE1
  Top 0.406: J4.1 155.55,7.42 153.92,9.04 153.92,16.43 149.12,21.23 142.82,21.23 141.76,22.3 IC31.3
  Bottom 0.406: J4.1 160.51,7.42 R143.1
DOBLE2
  Top 0.406: J4.2 157.1,9.91 154.89,12.12 154.89,16.82 148.95,22.76 IC32.3
  Bottom 0.406: J4.2 R144.1
DOBLE3
  Top 0.406: J4.3 157.78,12.42 155.96,14.25 155.96,26.72 IC33.3
  Bottom 0.406: J4.3 160.46,12.42 R145.1
DOBLE4
  Top 0.406: J4.4 163.01,16.17 IC34.3
  Bottom 0.406: J4.4 R146.1
DOUT1_1
  Top 0.2: U11.20 40.12,29.06 40.1,29.04
  Top 0.203: JP3.4 4.98,27.02 38.08,27.02 40.1,29.04
DOUT1_2
  Top 0.2: U11.19 39.62,30.07 39.6,30.05
  Top 0.203: JP3.5 37.85,28.3 39.6,30.05
DOUT1_3
  Top 0.2: U11.18 39.12,31.88 39.1,31.86
  Top 0.203: JP3.6 5,29.58 36.82,29.58 39.1,31.86
DOUT1_4
  Top 0.2: U11.17 38.62,32.89 38.6,32.87
  Top 0.203: JP3.7 36.58,30.84 38.6,32.87
DOUT1_5
  Top 0.2: U11.16 36.75,34.36 36.57,34.18
  Top 0.203: JP3.8 4.98,32.1 34.49,32.1 36.57,34.18
DOUT1_6
  Top 0.2: U11.15 35.48,44.55 35.25,44.32
  Top 0.203: 35.25,44.32 35.25,35.56 33.08,33.38 JP3.9
DOUT1_7
  Top 0.2: U11.14 35.11,45.05 34.68,44.62
  Top 0.203: 34.68,44.62 34.68,37.13 32.2,34.65 5,34.65 JP3.10
DOUT1_8
  Top 0.2: U11.13 34.54,45.55 33.94,44.95
  Top 0.203: 33.94,44.95 33.94,40.1 32.3,38.47 JP3.13
DOUT2_1
  Bottom 0.2: U6.20 67.53,28.11 66.7,27.28 28.37,27.28 26.89,28.76 26.89,37.62
  Bottom 0.203: 26.89,37.62 26.89,49.47 25.2,51.16 JP3.23
DOUT2_2
  Bottom 0.2: 26.31,37.5 26.31,28.1 27.71,26.7 67.21,26.7 68.03,27.52 U6.19
  Bottom 0.203: 26.31,37.5 26.31,47.74 24.15,49.9 5,49.9 JP3.22
DOUT2_3
  Bottom 0.2: 25.66,37.47 25.66,27.5 27.33,25.83 67.39,25.83 68.53,26.97 U6.18
  Bottom 0.203: 25.66,37.47 25.66,46.82 23.81,48.67 6.32,48.67 JP3.21
DOUT2_4
  Bottom 0.2: 25.08,37.36 25.08,26.96 26.8,25.25 67.84,25.25 69.03,26.43 U6.17
  Bottom 0.203: 25.08,37.36 25.08,45.62 23.34,47.36 5,47.36 JP3.20
DOUT2_5
  Bottom 0.2: U6.16 76.85,34.38 78.08,33.15 78.08,25.17 77.29,24.38 26.64,24.38 24.39,26.64 24.39,37.31
  Bottom 0.203: 24.39,37.31 24.39,44.59 22.89,46.09 JP3.19
DOUT2_6
  Bottom 0.2: 23.75,37.15 23.75,26.24 26.47,23.52 77.67,23.52 79.02,24.87 79.02,33.17 77.32,34.88 U6.15
  Bottom 0.203: 23.75,37.15 23.75,42.74 21.67,44.82 4.99,44.82 3.73,43.56 JP3.18
DOUT2_7
  Bottom 0.2: U6.14 77.7,35.38 79.88,33.2 79.88,24.51 78.21,22.84 26.16,22.84 23.18,25.82 23.18,37.02
  Bottom 0.203: 23.18,37.02 23.18,41.72 21.36,43.55 JP3.17
DOUT2_8
  Bottom 0.2: 22.43,36.97 22.43,25.52 25.68,22.28 78.87,22.28 80.82,24.23 80.82,33.22 78.17,35.88 U6.13
  Bottom 0.203: 22.43,36.97 22.43,40.68 20.83,42.28 5,42.28 JP3.16
DOUT3_1  (via drill 0.35)
  Top 0.2: v157.1,87.29 157.1,80.95 158.62,79.43 162.42,79.43 166.99,74.86 166.99,59.99 166.34,59.34 U9.20
  Route2 0.2: v157.1,87.29 157.02,87.37 94.36,87.37 93.12,86.13 93.12,58.25 89.85,54.98 87.22,54.98 JP2.13
DOUT3_2  (via drill 0.35)
  Top 0.2: v158,86.33 158,81.37 159.29,80.08 162.64,80.08 167.53,75.19 167.53,59.81 166.56,58.84 U9.19
  Route2 0.2: v158,86.33 156.63,86.33 156.1,86.86 95.18,86.86 93.84,85.52 93.84,57.15 90.39,53.7 JP2.16
DOUT3_3  (via drill 0.35)
  Top 0.2: v158.8,85.02 158.78,85 158.78,81.78 159.68,80.88 162.71,80.88 167.99,75.6 167.99,59.63 166.71,58.34 U9.18
  Route2 0.2: v158.8,85.02 154.29,80.51 95.98,80.51 94.56,79.09 94.56,57.1 89.9,52.44 87.18,52.44 85.96,53.66 JP2.15
DOUT3_4  (via drill 0.35)
  Top 0.2: v162.52,77.72 159.18,77.72 156.12,80.78 v156.12,85.69 | v110.82,85.99 107.54,89.27 94.71,89.27 90.5,85.06 90.5,52.09 89.58,51.16 JP2.18 | U9.17 165.54,57.84 v165.82,57.57
  Route2 0.2: v165.82,57.57 165.82,74.42 v162.52,77.72 | v156.12,85.69 155.47,86.34 111.17,86.34 v110.82,85.99
DRDY1
  Top 0.2: U11.29 44.62,24.91 44.6,24.89
  Top 0.203: JP3.1 42.94,23.23 44.6,24.89
DRDY2
  Bottom 0.2: U6.29 63.03,30.01 62.31,29.29 30.05,29.29 28.48,30.85 28.48,38.41
  Bottom 0.203: 28.48,38.41 28.48,51.96 25.47,54.97 5,54.97 JP3.26
DRDY3  (via drill 0.35)
  Top 0.2: U9.29 159.5,63.84 v159.74,64.09
  Route2 0.2: v159.74,64.09 159.74,86.69 158.5,87.93 94.06,87.93 92.59,86.46 92.59,58.59 90.23,56.23 88.52,56.23 JP2.14
GND  (via drill 0.35, 0.35 pad 0.4)
  Top 0.2: U2.4 66.48,59.65 C38.2 | U9.30 158.91,64.34 160.2,65.63 163.68,65.63 164.44,64.87 164.44,62.76 C107.2
  Top 0.406: C37.2 C36.2 | C102.2 130.76,56.07 C103.2
  Bottom 0.2: 72.19,38.91 72.19,39.34 72.16,39.38 U6.6 69.59,39.38 69.55,39.33 69.55,38.91 | 72.19,38.91 72.19,38.38 | 72.19,38.38 72.19,37.92 72.14,37.87 U6.9 69.55,37.88 69.55,37.87 69.55,38.38 | 72.19,38.38 72.18,38.38 U6.8 69.55,38.38 | 72.19,38.91 72.15,38.88 U6.7 69.58,38.88 69.55,38.91 | 69.55,38.38 69.55,38.91 | U6.54 64.03,42.65 64.08,42.6 65.53,42.6 | 65.53,42.6 66.02,42.6 | 66.02,42.6 66.5,42.6 66.53,42.63 U6.59 | 66.02,42.6 66.03,42.61 U6.58 66.03,45.5 v66.06,45.53 | U6.57 65.53,42.6 | U6.24 65.53,33.58 65.48,33.63 65.05,33.63 65.03,33.61 U6.25 65.03,31.35 65,31.32 65.22,31.1 65.28,31.1 65.53,31.35 U6.24
  other vias: 140.47,39.6 153.76,39.58 166.74,38.57 132.65,31.61 15.13,76.51 14.2,94.17 30.78,100.25 30.87,82.19 45.94,100.25 46.93,81.51 63.71,83 62.78,100.22 40.97,55.77 58.25,68.28 63.67,61.59 43.92,55.58 145.04,60.51 32.52,40.24 73.18,78.65 57.1,77.95 41.8,77.78 25.69,77.81 25.44,96.22 41.42,96.25 57.37,96.28 73.05,96.1 17.73,111.9 41.83,34.1 66.77,28.39 70.46,33.16 147.47,55.97 158.01,43.37 144.78,43.7 131.52,44.06 127.38,22.8 130.65,63.13 60.74,101.83 23.34,71.67 17.01,88.92 22.98,88.97
  pour Top (isolate 0.254): 0,0 0,130 170,130 170,0
  pour Route2: 0,130 0,0 170,0 170,130
  pour Route15: 0,130 0,0 170,0 170,130
  pour Bottom: 170,0 0,0 0,130 170,130
GPIO4  (via drill 0.35)
  Top 0.2: v13.01,98.28 11.79,98.28 R139.1
  Route15 0.2: JP1.7 108.92,39.26 106.63,39.26 93.72,52.17 93.72,93.71 89.15,98.28 v13.01,98.28
GPIO17  (via drill 0.35)
  Top 0.2: v13.23,106.6 11.88,105.25 11.88,101.69 R140.1
  Route15 0.2: JP1.11 108.99,44.27 106.67,44.27 94.64,56.3 94.64,93.75 89.41,98.98 28.12,98.98 20.5,106.6 v13.23,106.6
GPIO22  (via drill 0.35)
  Top 0.2: v13.12,108.86 10.67,108.86 R142.1
  Route15 0.2: JP1.15 109.02,49.32 106.58,49.32 96.54,59.36 96.54,93.84 89.49,100.89 27.86,100.89 19.89,108.86 v13.12,108.86
GPIO27  (via drill 0.35)
  Top 0.2: v13.17,107.66 11.32,105.81 11.32,103.91 10.31,102.9 R141.1
  Route15 0.2: JP1.13 108.94,46.86 106.5,46.86 95.62,57.74 95.62,93.74 89.78,99.58 28.37,99.58 20.29,107.66 v13.17,107.66
INPUT1+
  Top 0.203: R1.2 21.54,104.38 14.49,111.43 6.72,111.43 4.88,113.27 JP4.1
INPUT1-
  Top 0.203: R4.2 18.49,99.28 18.49,106.73 14.29,110.93 6.27,110.93 2.96,114.24 2.96,122.18 JP4.2
INPUT2+
  Top 0.203: R7.2 21.51,81.22 22.24,81.95 24.2,81.95 26.41,84.16 26.41,91.38 23.73,94.06 23.73,103.57 14.82,112.48 8.48,112.48 7.42,113.54 JP4.3
INPUT2-
  Top 0.203: JP4.4 6.15,122.84 6.15,113.21 7.4,111.96 14.59,111.96 23.2,103.35 23.2,93.5 26.03,90.66 26.03,84.69 24.68,83.34 22.78,83.34 18.92,79.48 R10.2
INPUT3+
  Top 0.203: R13.2 26.7,113.4 11.31,113.4 9.96,114.75 JP4.5
INPUT3-
  Top 0.203: R16.2 23.76,112.93 9.69,112.93 8.67,113.95 8.67,122.81 JP4.6
INPUT4+
  Top 0.203: R19.2 37.8,85 42.06,89.25 42.06,102.54 30.13,114.47 13.54,114.47 12.5,115.51 JP4.7
INPUT4-
  Top 0.203: R22.2 37.52,89.03 39.94,89.03 40.65,89.74 40.65,103.12 29.83,113.94 12.48,113.94 11.24,115.18 11.24,122.84 JP4.8
INPUT5+
  Top 0.203: R25.2 40.55,115.42 16.58,115.42 15.04,116.96 JP4.9
INPUT5-
  Top 0.203: R28.2 37.67,114.93 15.43,114.93 13.76,116.6 13.76,122.82 JP4.10
INPUT6+
  Top 0.203: R31.2 54.83,84.75 59.8,89.71 59.8,99.14 42.54,116.4 19.23,116.4 17.58,118.05 JP4.11
INPUT6-
  Top 0.203: R34.2 53.86,88.38 57.58,88.38 58.95,89.75 58.95,99.33 42.36,115.91 17.98,115.91 16.32,117.57 16.32,122.84 JP4.12
INPUT7+
  Top 0.203: R37.2 68.04,103.67 56.88,103.67 43.14,117.41 21.45,117.41 20.12,118.74 JP4.13
INPUT7-
  Top 0.203: R40.2 57.36,102.48 42.89,116.95 20.14,116.95 18.86,118.23 18.86,122.84 JP4.14
INPUT8+
  Top 0.203: R43.2 72.63,85.55 75.84,88.76 75.84,98.78 69.84,104.78 57.37,104.78 43.77,118.38 23.91,118.38 22.62,119.67 22.62,121.52 JP4.15
INPUT8-
  Top 0.203: R46.2 68.78,87.96 73.91,87.96 75.23,89.27 75.23,98.64 69.66,104.21 57.14,104.21 43.47,117.88 22.67,117.88 21.39,119.16 21.39,122.87 22.62,124.1 JP4.16
INPUT9+
  Bottom 0.305: R55.2 61.02,98.8 56.41,103.41 49.15,103.41 42.95,109.61 42.95,121.53 JP4.31
INPUT9-
  Bottom 0.305: R58.2 68.38,101.09 60.1,101.09 56.81,104.38 49.63,104.38 44.23,109.78 44.23,122.87 43,124.1 JP4.32
INPUT10+
  Bottom 0.305: R61.2 63.13,81.19 60.21,84.11 60.21,96.74 55.7,101.25 48.34,101.25 40.44,109.15 JP4.29
INPUT10-
  Bottom 0.305: R64.2 69.36,82.23 63.31,82.23 61.24,84.31 61.24,97.11 56.04,102.31 48.73,102.31 41.69,109.35 41.69,122.85 JP4.30
INPUT11+
  Bottom 0.305: R67.2 48.04,99.11 37.9,109.25 JP4.27
INPUT11-
  Bottom 0.305: R70.2 52.76,100.35 47.76,100.35 39.17,108.94 39.17,122.94 38.01,124.1 JP4.28
INPUT12+
  Bottom 0.305: R73.2 45.84,80.8 44.64,82 44.64,99.52 35.36,108.8 JP4.25
INPUT12-
  Bottom 0.305: R76.2 52.81,82.28 46.04,82.28 45.35,82.97 45.35,99.83 36.63,108.55 36.63,122.83 JP4.26
INPUT13+
  Bottom 0.305: R79.2 35.48,105.69 32.82,108.35 JP4.23
INPUT13-
  Bottom 0.305: R82.2 39,103.69 34.08,108.61 34.08,122.84 JP4.24
INPUT14+
  Bottom 0.305: R85.2 30.59,80.97 29.18,82.38 29.18,117.89 30.28,118.99 JP4.21
INPUT14-
  Bottom 0.305: R88.2 37.41,82.23 32.31,82.23 30.08,84.46 30.08,117.43 31.54,118.89 31.54,122.9 30.34,124.1 JP4.22
INPUT15+
  Bottom 0.305: R91.2 18.93,110.82 27.74,119.63 JP4.19
INPUT15-